# EAGLE schematic AM_BE200_x24_Rev2 (EAGLE 6.5.0), part 1 of 3
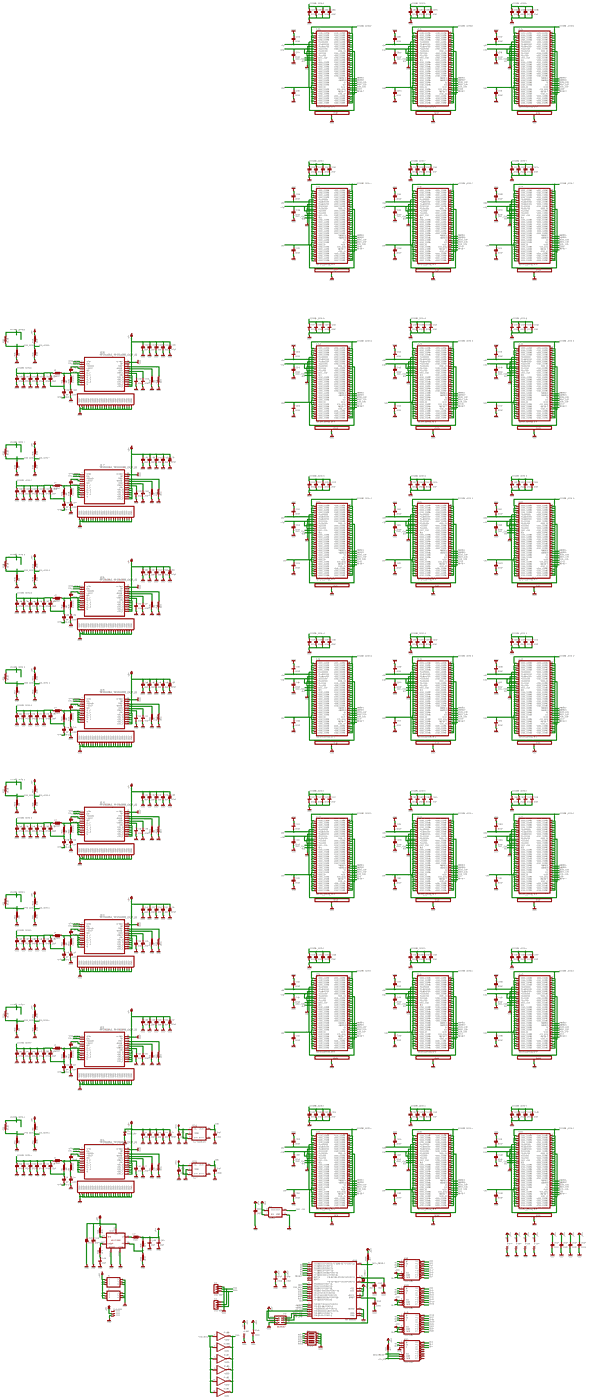
[diagram p0: schematic, sheet 1, overview]
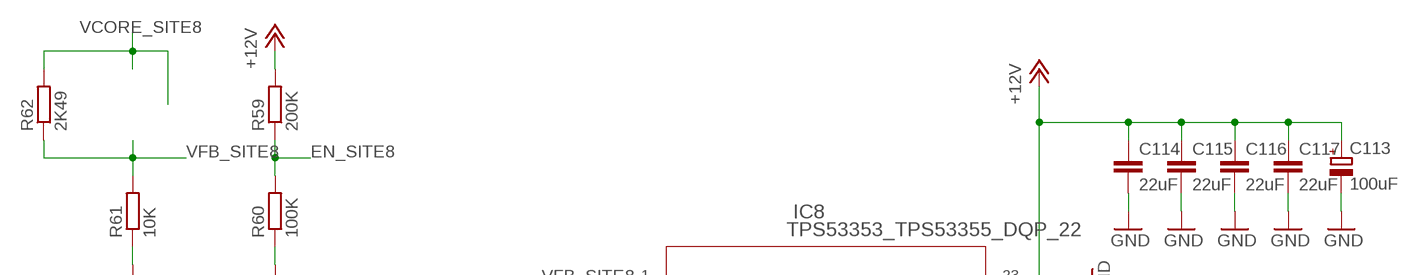
[diagram p1: schematic, sheet 1, part 1 of 8]
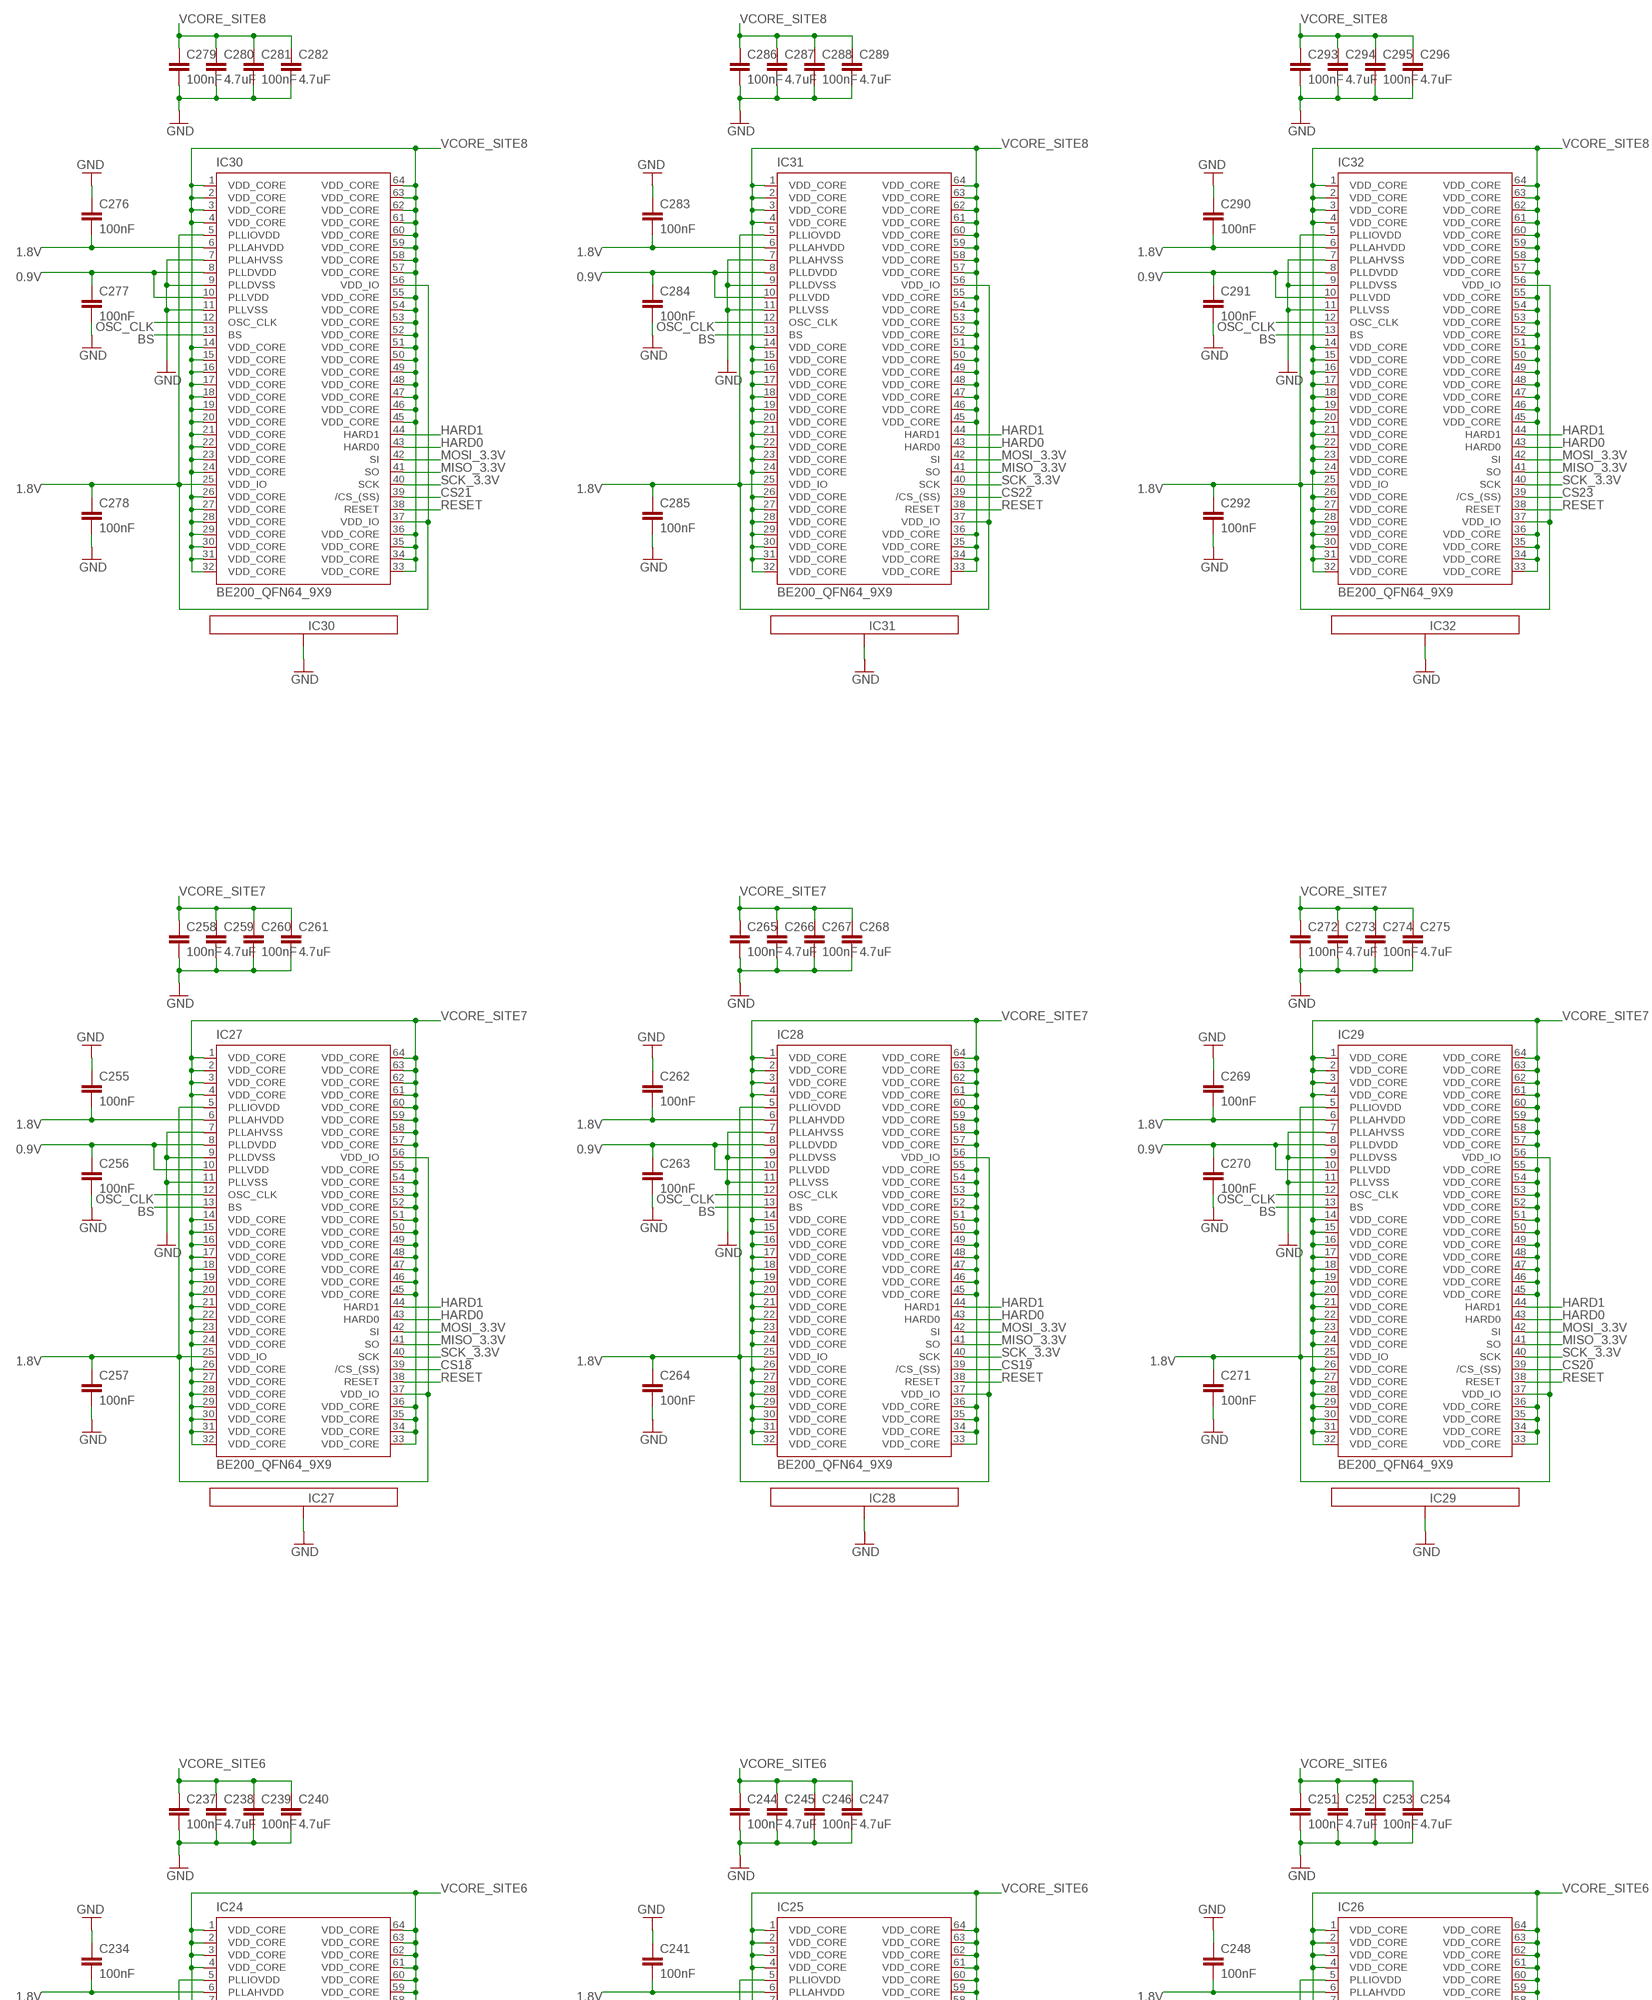
[diagram p2: schematic, sheet 1, part 2 of 8]
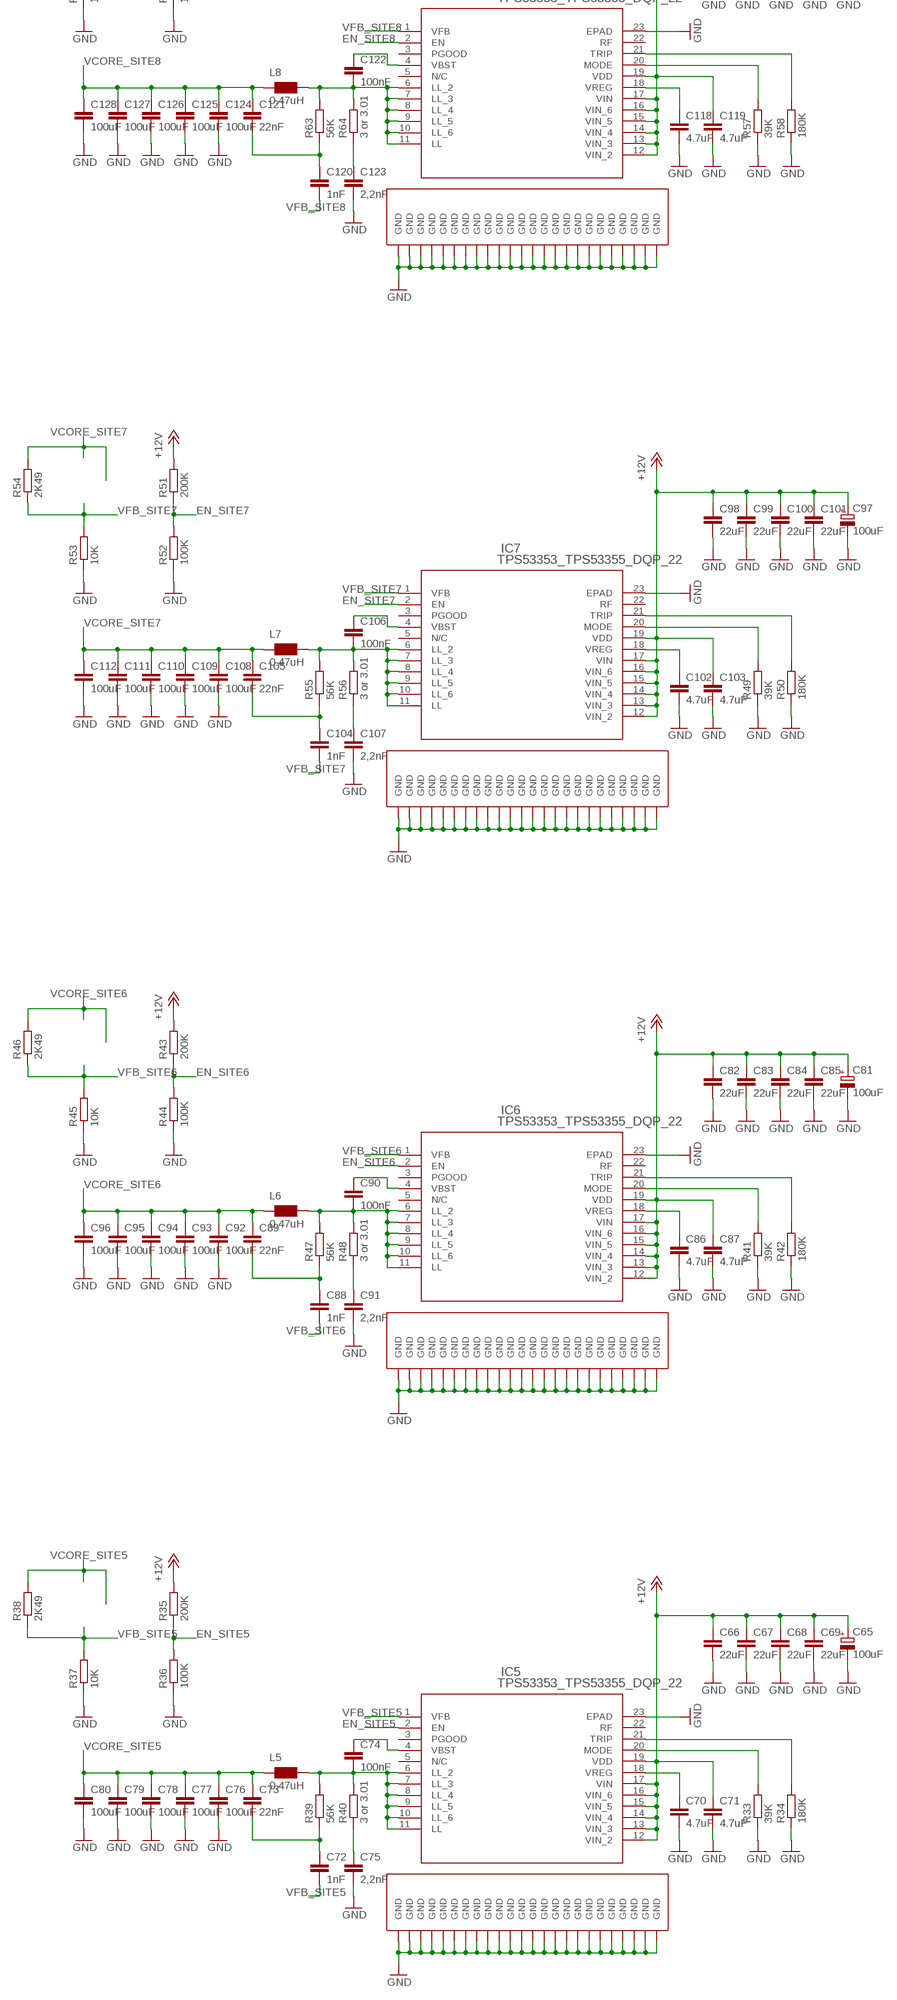
[diagram p3: schematic, sheet 1, part 3 of 8]
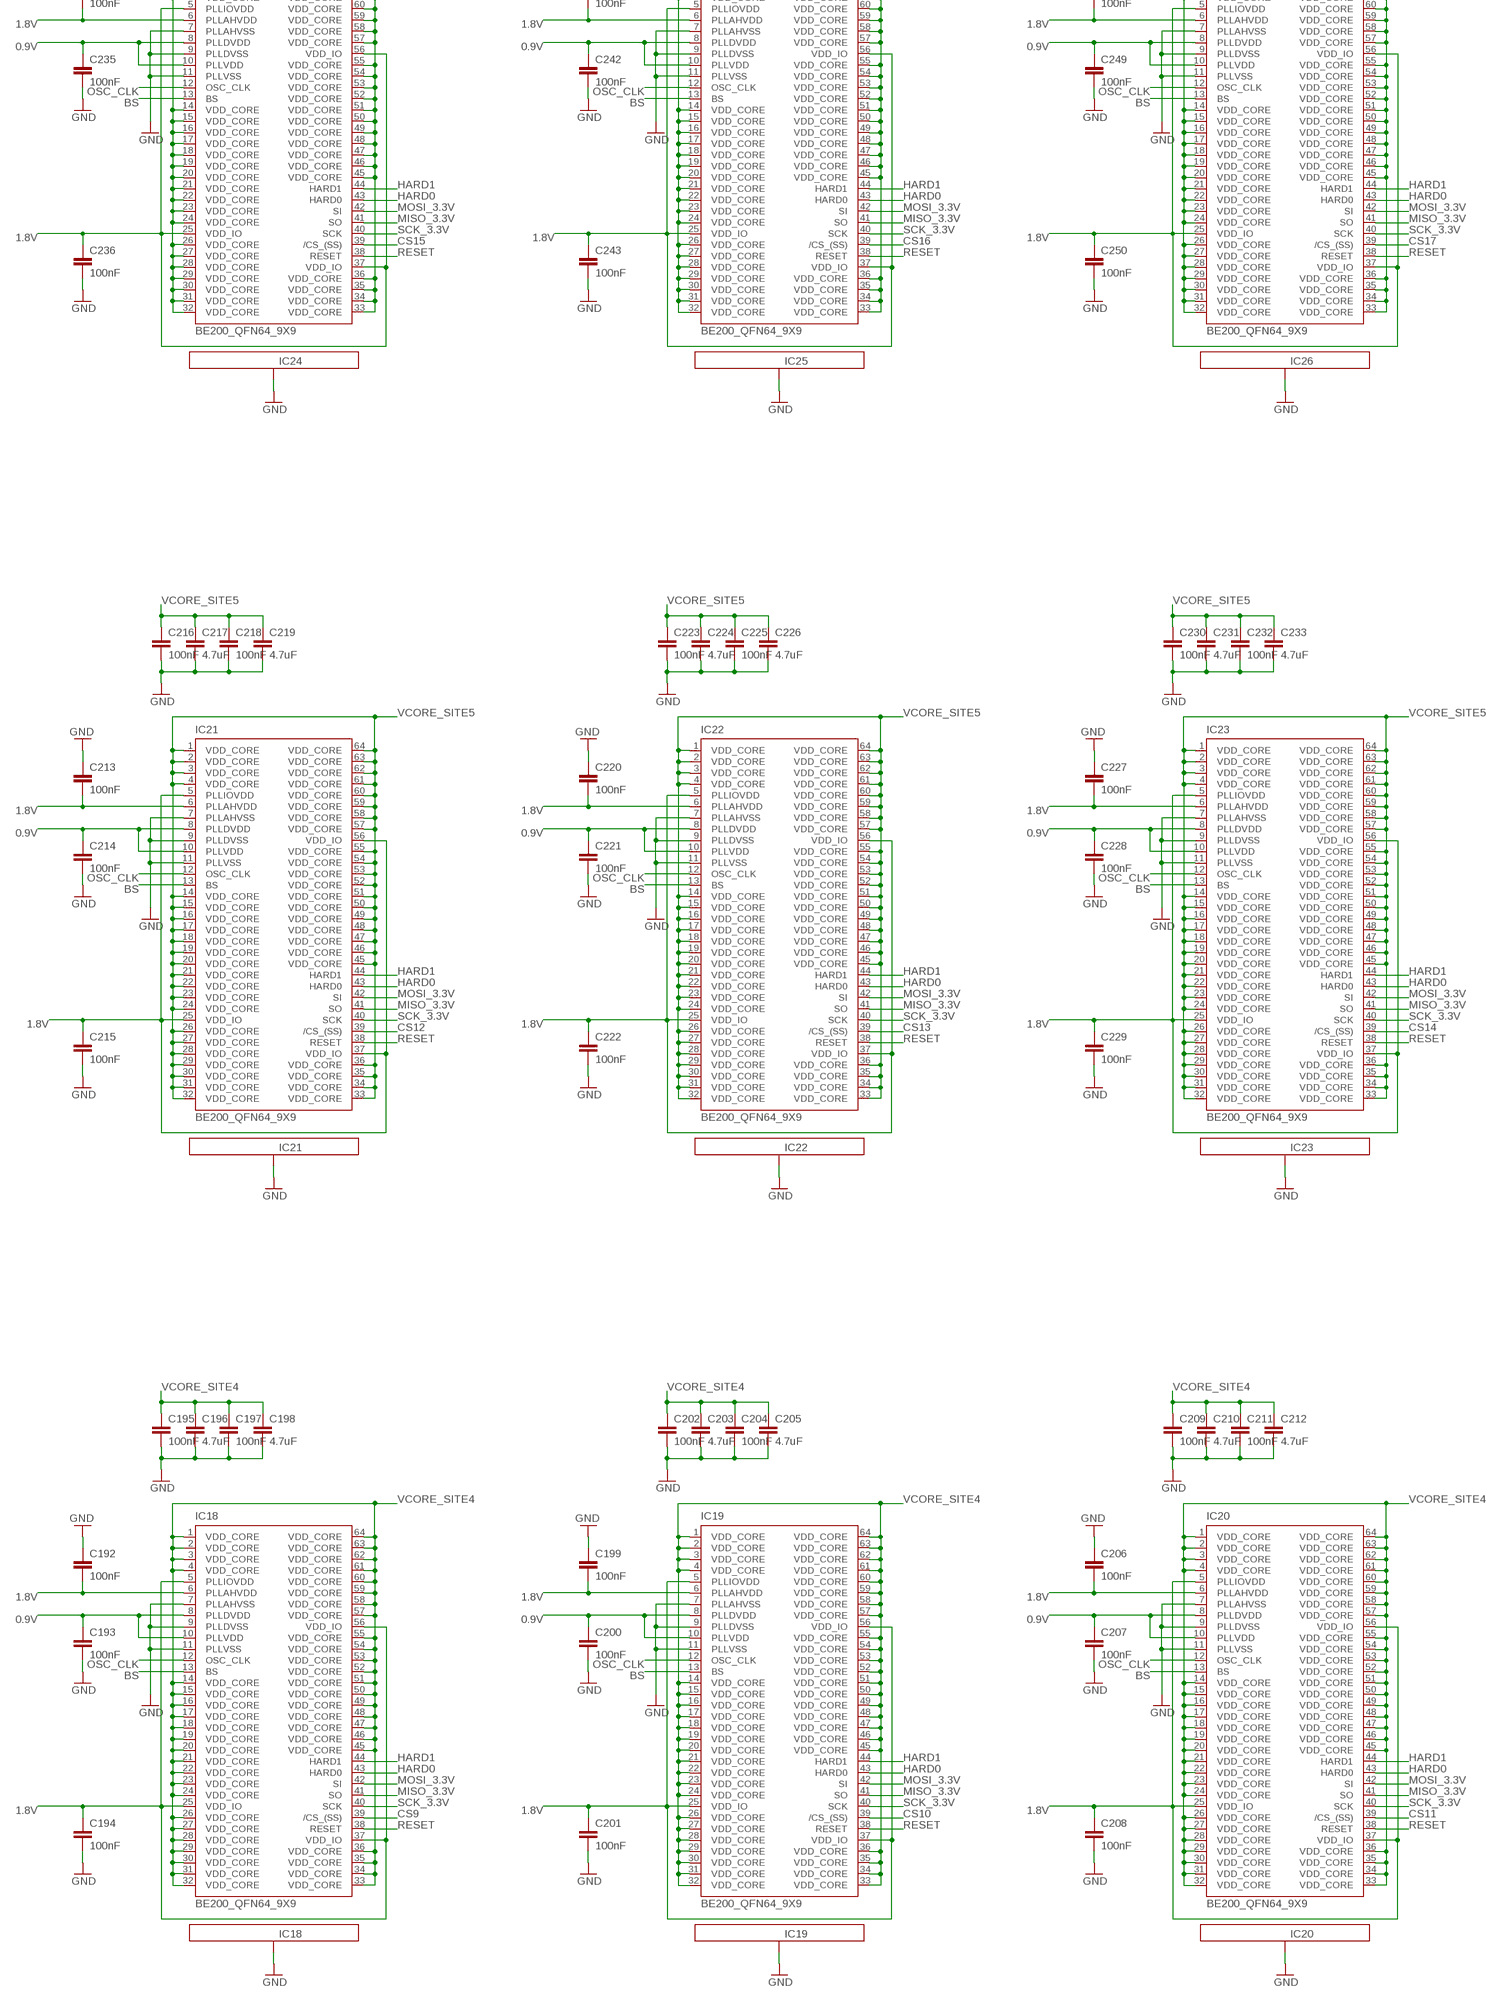
[diagram p4: schematic, sheet 1, part 4 of 8]
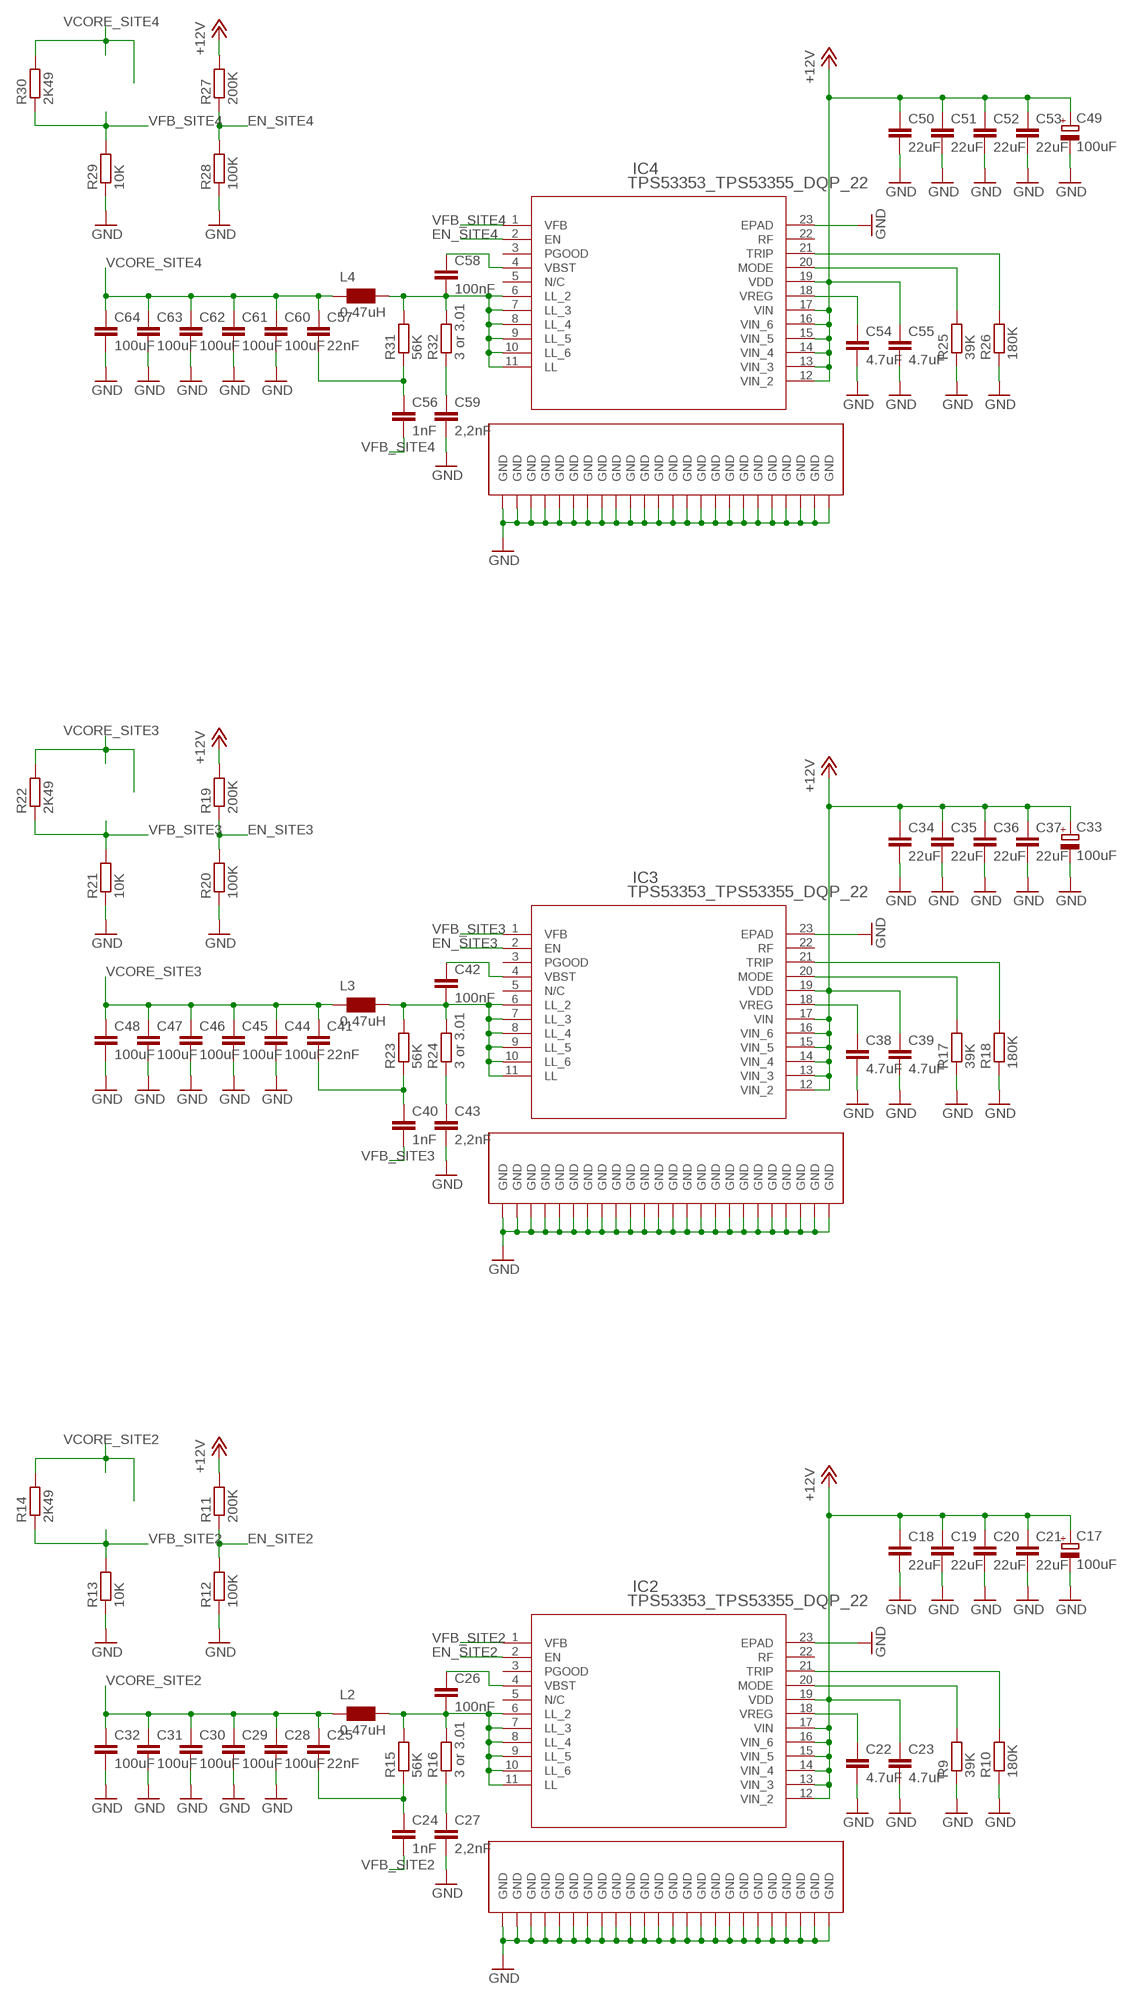
[diagram p5: schematic, sheet 1, part 5 of 8]
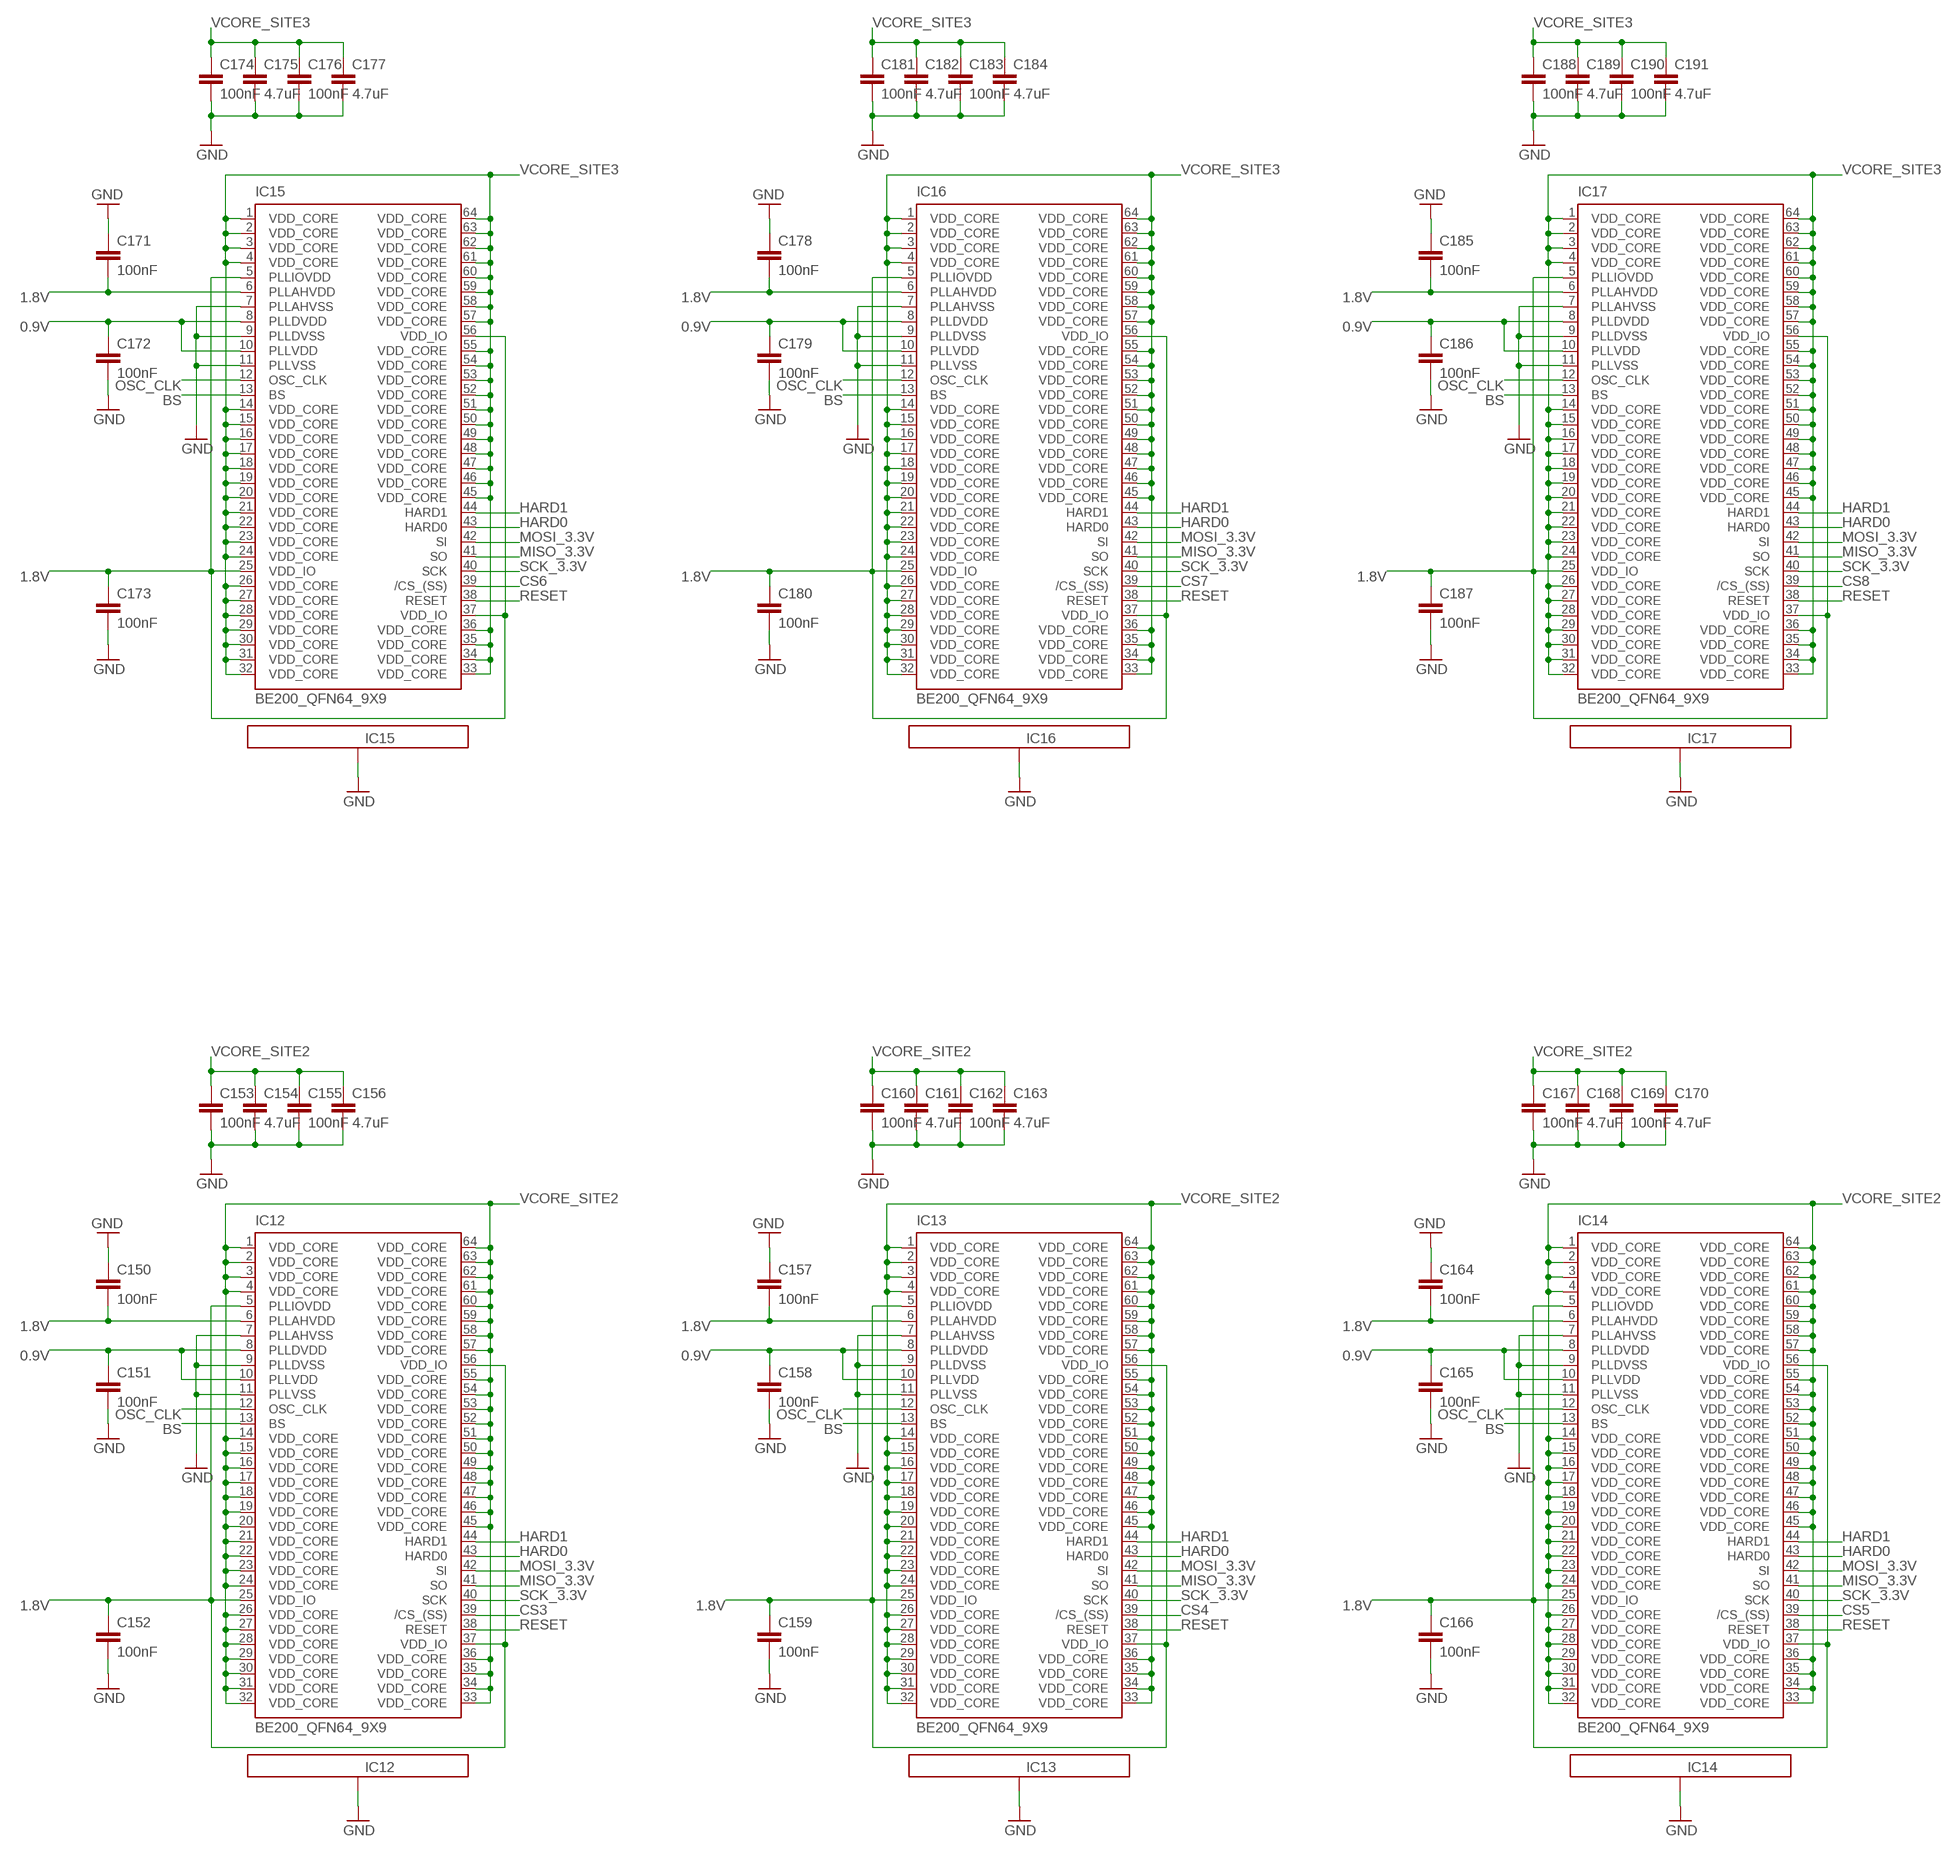
[diagram p6: schematic, sheet 1, part 6 of 8]
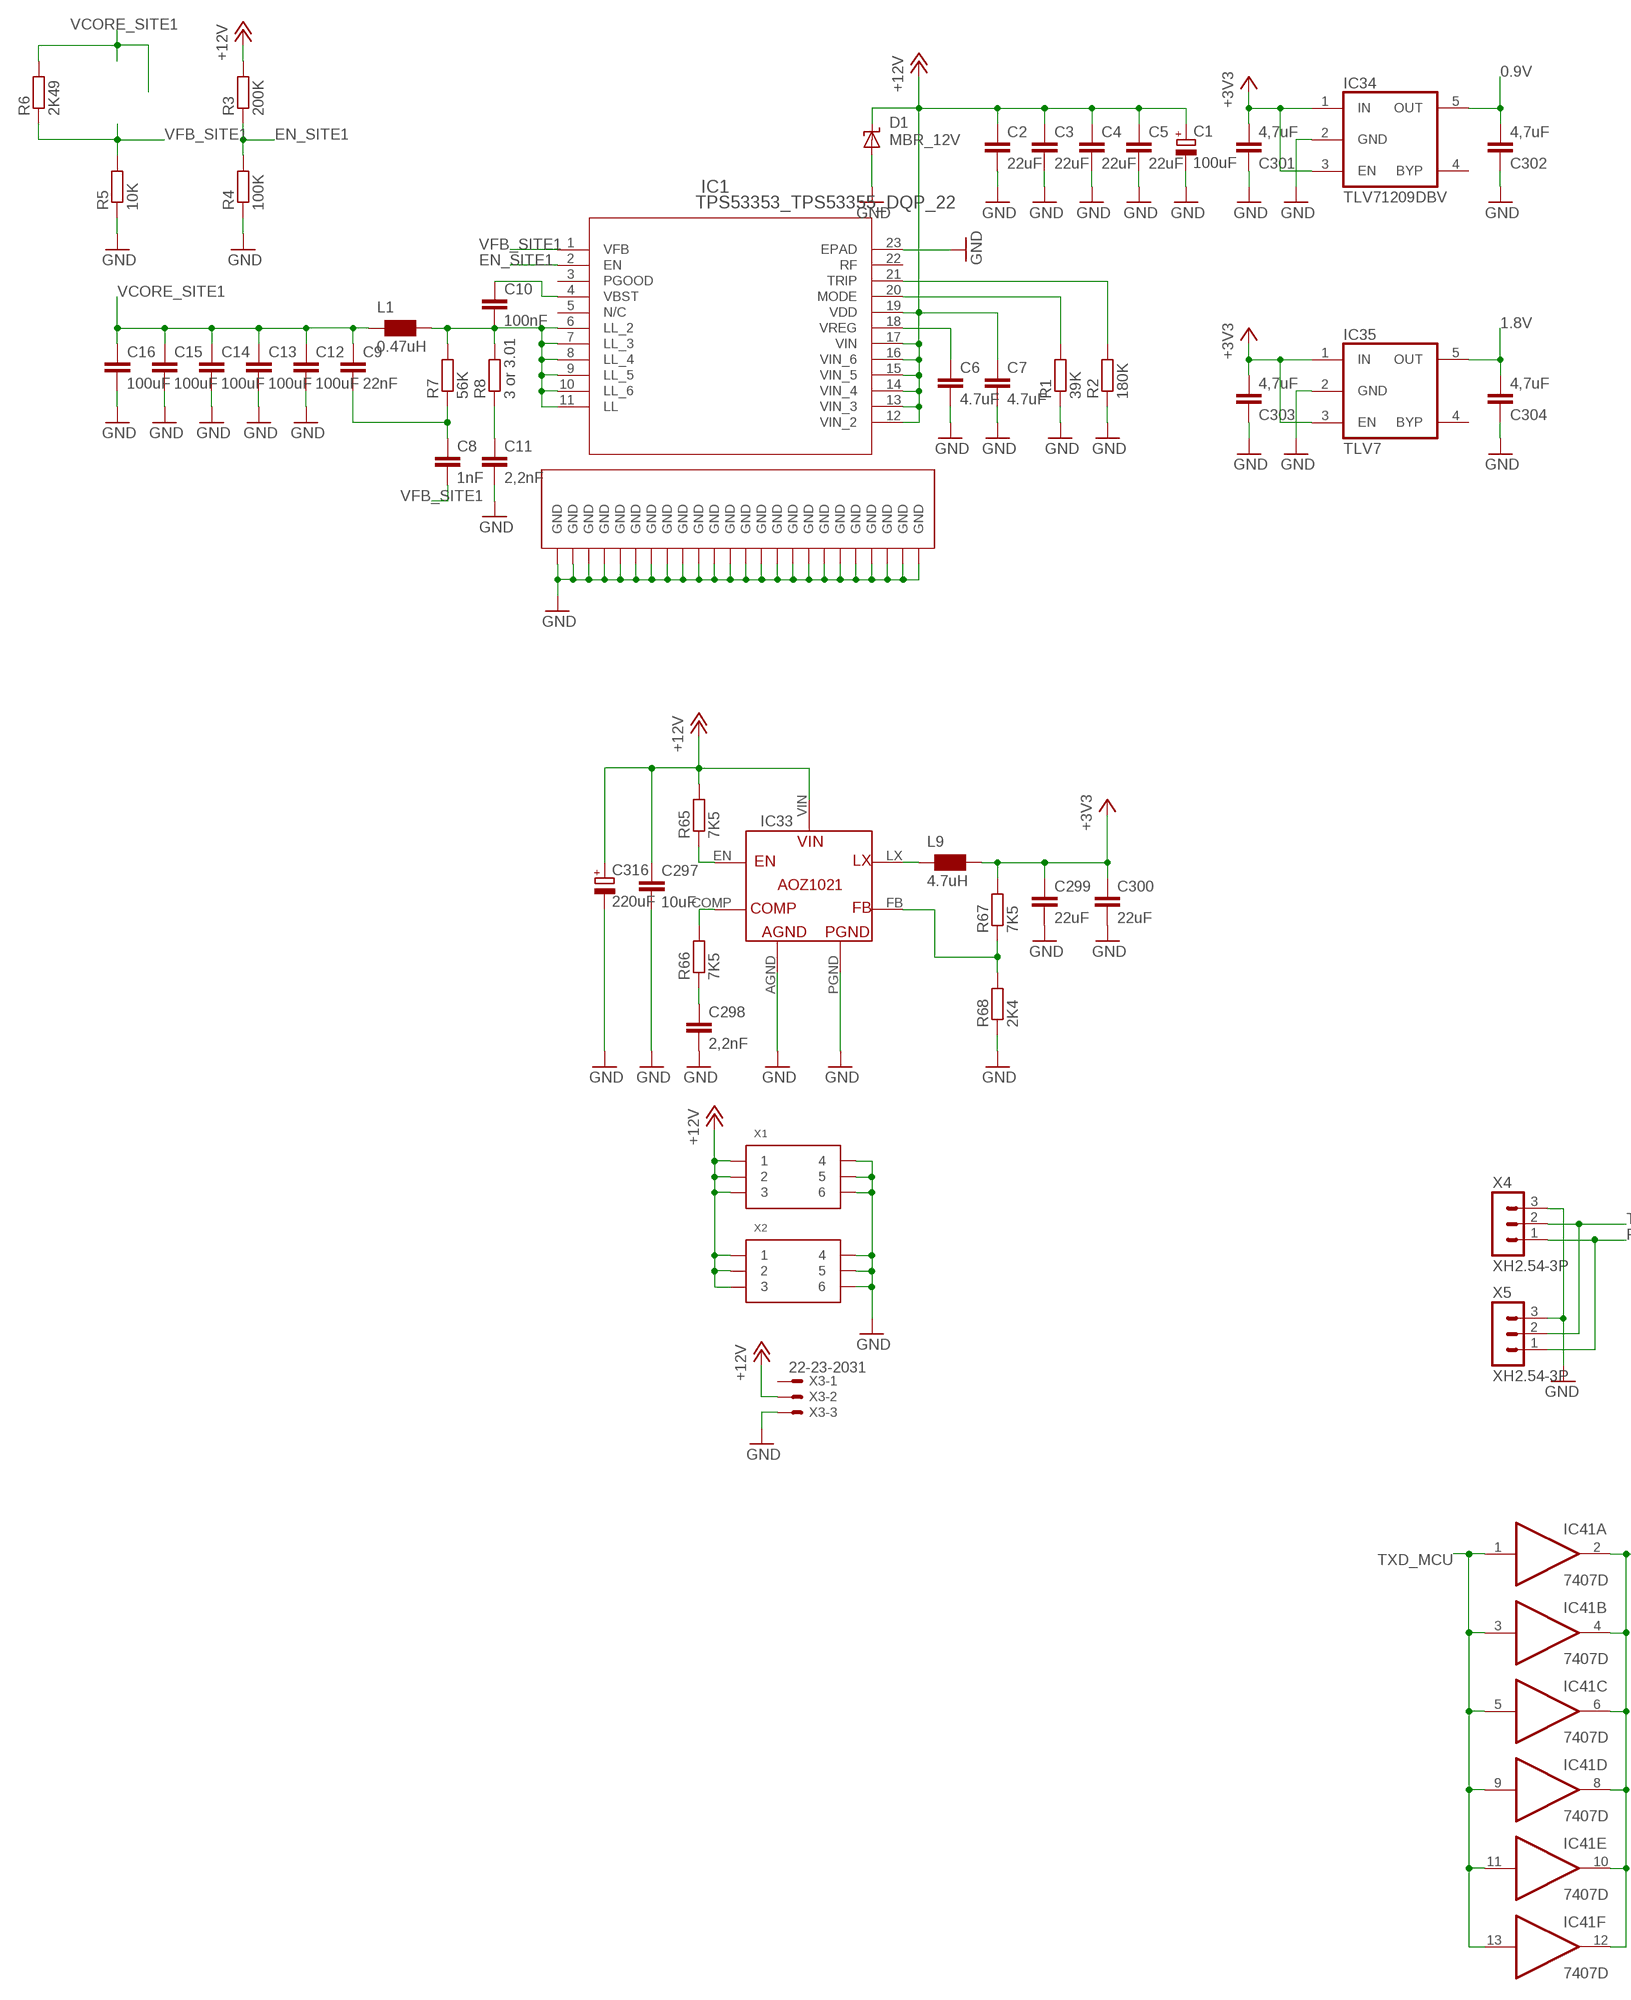
[diagram p7: schematic, sheet 1, part 7 of 8]
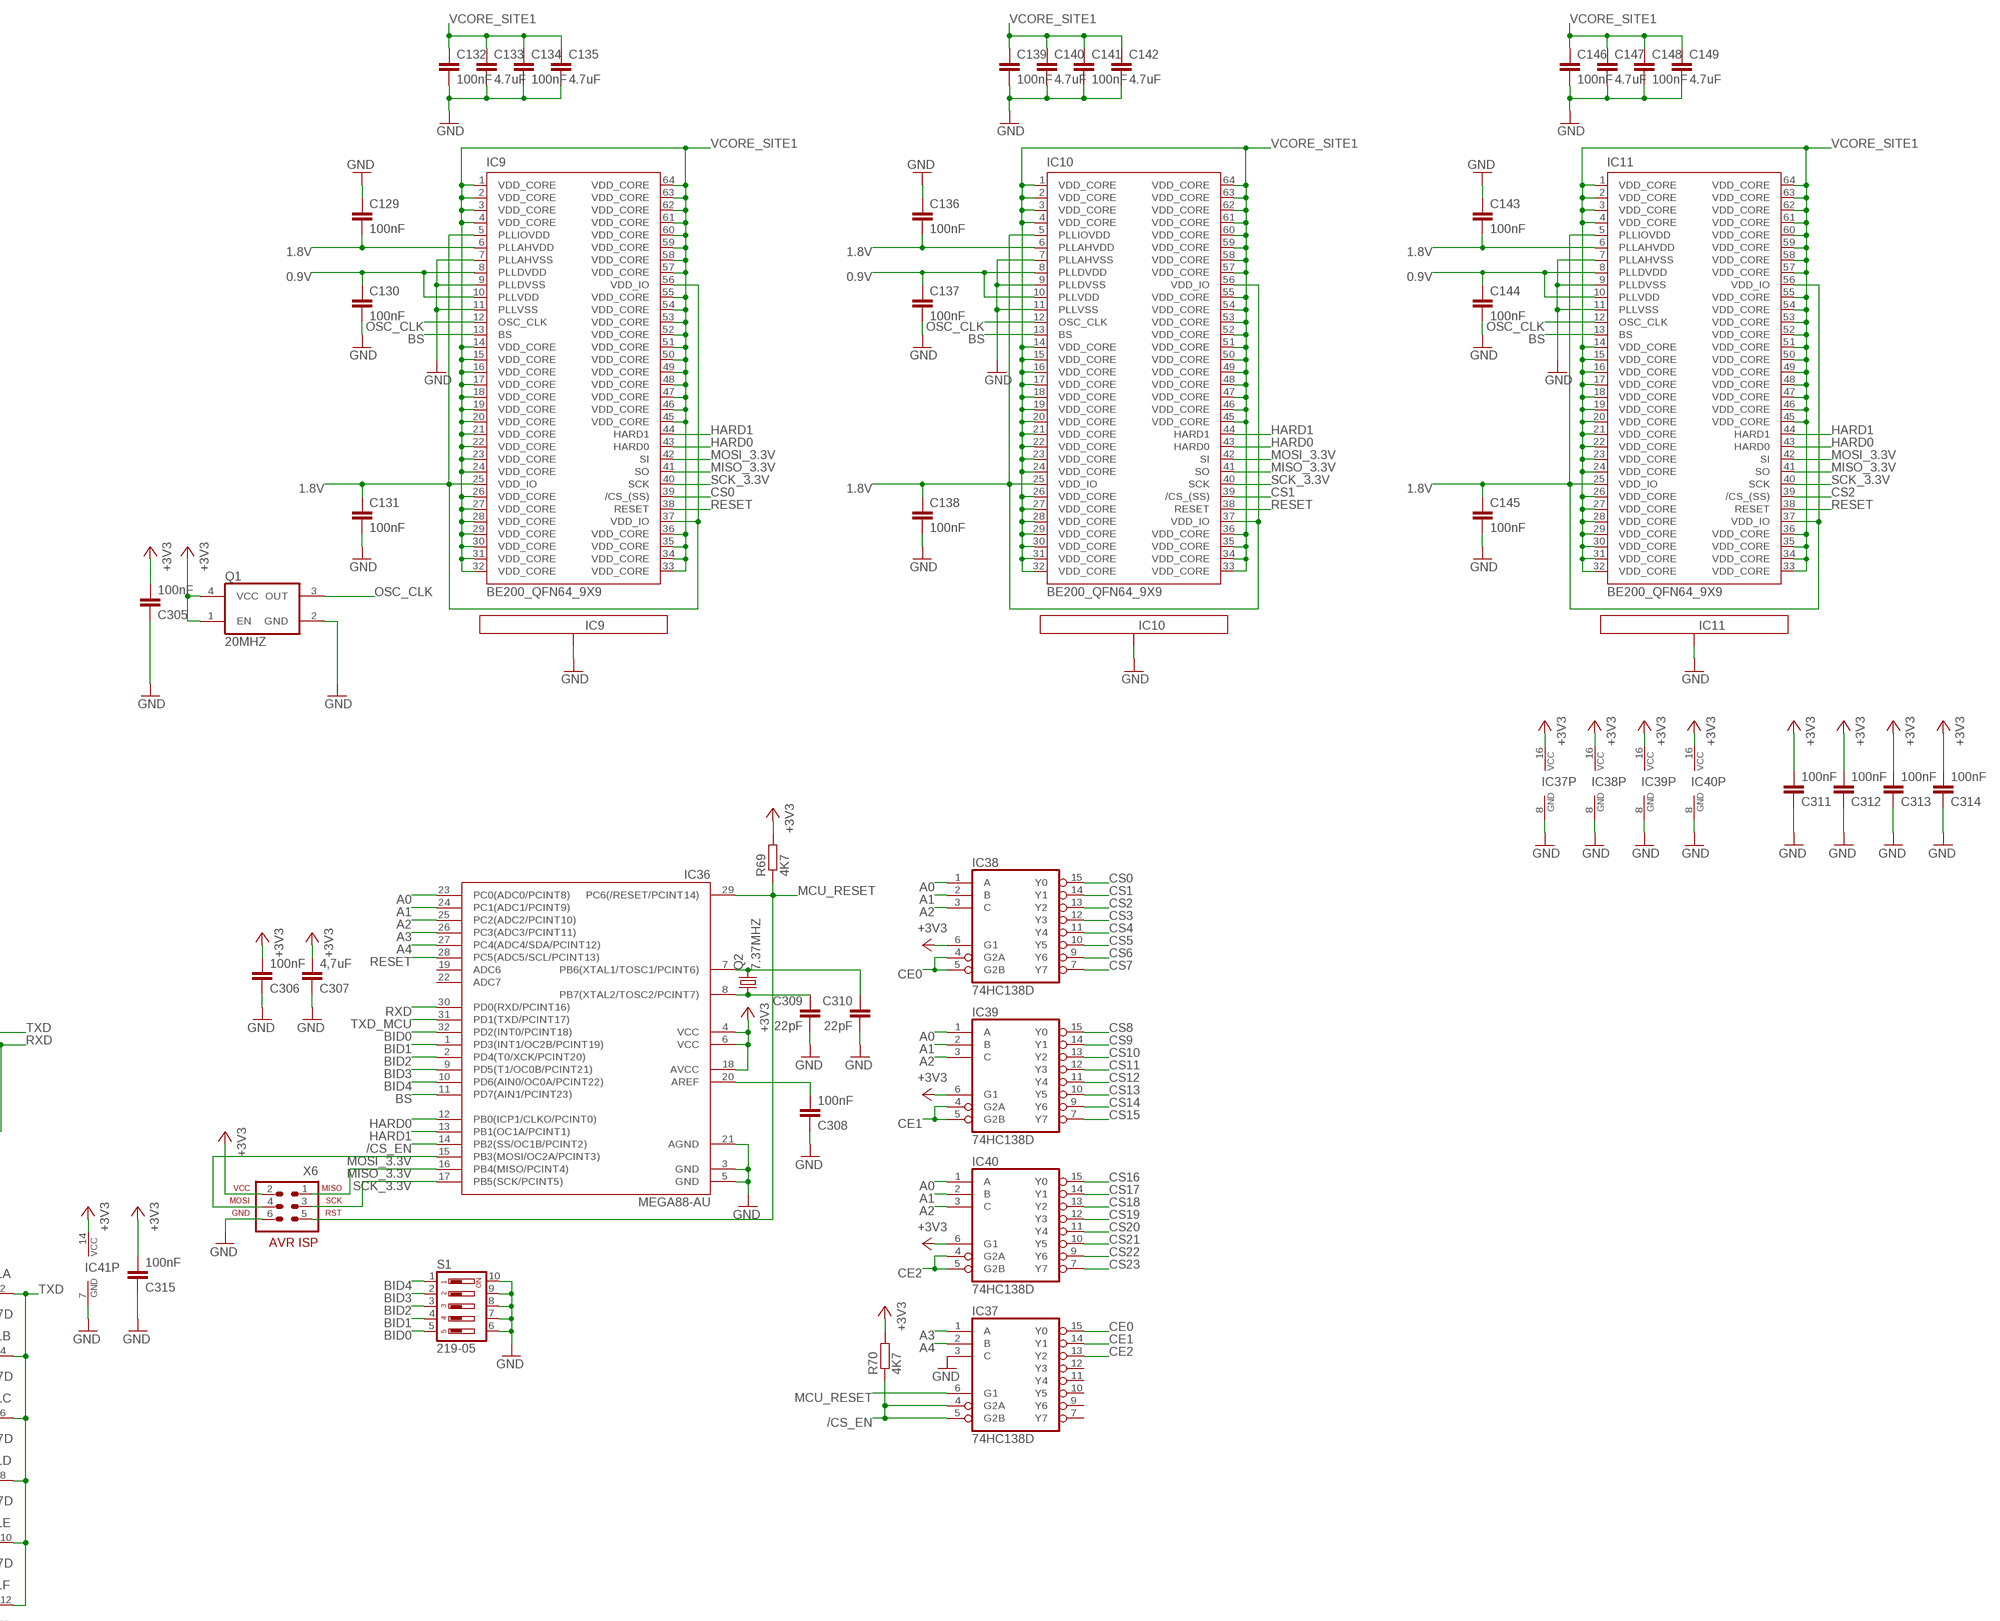
[diagram p8: schematic, sheet 1, part 8 of 8]

## Parts
C1  100uF  CPOL-EU153CLV-0605  [153CLV-0605]
C2  22uF  C-EUC1210K  [C1210K]
C3  22uF  C-EUC1210K  [C1210K]
C4  22uF  C-EUC1210K  [C1210K]
C5  22uF  C-EUC1210K  [C1210K]
C6  4.7uF  C-EUC0805K  [C0805K]
C7  4.7uF  C-EUC0805K  [C0805K]
C8  1nF  C-EUC0805K  [C0805K]
C9  22nF  C-EUC0805K  [C0805K]
C10  100nF  C-EUC0805K  [C0805K]
C11  2,2nF  C-EUC0805K  [C0805K]
C12  100uF  C-EUC1210K  [C1210K]
C13  100uF  C-EUC1210K  [C1210K]
C14  100uF  C-EUC1210K  [C1210K]
C15  100uF  C-EUC1210K  [C1210K]
C16  100uF  C-EUC1210K  [C1210K]
C17  100uF  CPOL-EU153CLV-0605  [153CLV-0605]
C18  22uF  C-EUC1210K  [C1210K]
C19  22uF  C-EUC1210K  [C1210K]
C20  22uF  C-EUC1210K  [C1210K]
C21  22uF  C-EUC1210K  [C1210K]
C22  4.7uF  C-EUC0805K  [C0805K]
C23  4.7uF  C-EUC0805K  [C0805K]
C24  1nF  C-EUC0805K  [C0805K]
C25  22nF  C-EUC0805K  [C0805K]
C26  100nF  C-EUC0805K  [C0805K]
C27  2,2nF  C-EUC0805K  [C0805K]
C28  100uF  C-EUC1210K  [C1210K]
C29  100uF  C-EUC1210K  [C1210K]
C30  100uF  C-EUC1210K  [C1210K]
C31  100uF  C-EUC1210K  [C1210K]
C32  100uF  C-EUC1210K  [C1210K]
C33  100uF  CPOL-EU153CLV-0605  [153CLV-0605]
C34  22uF  C-EUC1210K  [C1210K]
C35  22uF  C-EUC1210K  [C1210K]
C36  22uF  C-EUC1210K  [C1210K]
C37  22uF  C-EUC1210K  [C1210K]
C38  4.7uF  C-EUC0805K  [C0805K]
C39  4.7uF  C-EUC0805K  [C0805K]
C40  1nF  C-EUC0805K  [C0805K]
C41  22nF  C-EUC0805K  [C0805K]
C42  100nF  C-EUC0805K  [C0805K]
C43  2,2nF  C-EUC0805K  [C0805K]
C44  100uF  C-EUC1210K  [C1210K]
C45  100uF  C-EUC1210K  [C1210K]
C46  100uF  C-EUC1210K  [C1210K]
C47  100uF  C-EUC1210K  [C1210K]
C48  100uF  C-EUC1210K  [C1210K]
C49  100uF  CPOL-EU153CLV-0605  [153CLV-0605]
C50  22uF  C-EUC1210K  [C1210K]
C51  22uF  C-EUC1210K  [C1210K]
C52  22uF  C-EUC1210K  [C1210K]
C53  22uF  C-EUC1210K  [C1210K]
C54  4.7uF  C-EUC0805K  [C0805K]
C55  4.7uF  C-EUC0805K  [C0805K]
C56  1nF  C-EUC0805K  [C0805K]
C57  22nF  C-EUC0805K  [C0805K]
C58  100nF  C-EUC0805K  [C0805K]
C59  2,2nF  C-EUC0805K  [C0805K]
C60  100uF  C-EUC1210K  [C1210K]
C61  100uF  C-EUC1210K  [C1210K]
C62  100uF  C-EUC1210K  [C1210K]
C63  100uF  C-EUC1210K  [C1210K]
C64  100uF  C-EUC1210K  [C1210K]
C65  100uF  CPOL-EU153CLV-0605  [153CLV-0605]
C66  22uF  C-EUC1210K  [C1210K]
C67  22uF  C-EUC1210K  [C1210K]
C68  22uF  C-EUC1210K  [C1210K]
C69  22uF  C-EUC1210K  [C1210K]
C70  4.7uF  C-EUC0805K  [C0805K]
C71  4.7uF  C-EUC0805K  [C0805K]
C72  1nF  C-EUC0805K  [C0805K]
C73  22nF  C-EUC0805K  [C0805K]
C74  100nF  C-EUC0805K  [C0805K]
C75  2,2nF  C-EUC0805K  [C0805K]
C76  100uF  C-EUC1210K  [C1210K]
C77  100uF  C-EUC1210K  [C1210K]
C78  100uF  C-EUC1210K  [C1210K]
C79  100uF  C-EUC1210K  [C1210K]
C80  100uF  C-EUC1210K  [C1210K]
C81  100uF  CPOL-EU153CLV-0605  [153CLV-0605]
C82  22uF  C-EUC1210K  [C1210K]
C83  22uF  C-EUC1210K  [C1210K]
C84  22uF  C-EUC1210K  [C1210K]
C85  22uF  C-EUC1210K  [C1210K]
C86  4.7uF  C-EUC0805K  [C0805K]
C87  4.7uF  C-EUC0805K  [C0805K]
C88  1nF  C-EUC0805K  [C0805K]
C89  22nF  C-EUC0805K  [C0805K]
C90  100nF  C-EUC0805K  [C0805K]
C91  2,2nF  C-EUC0805K  [C0805K]
C92  100uF  C-EUC1210K  [C1210K]
C93  100uF  C-EUC1210K  [C1210K]
C94  100uF  C-EUC1210K  [C1210K]
C95  100uF  C-EUC1210K  [C1210K]
C96  100uF  C-EUC1210K  [C1210K]
C97  100uF  CPOL-EU153CLV-0605  [153CLV-0605]
C98  22uF  C-EUC1210K  [C1210K]
C99  22uF  C-EUC1210K  [C1210K]
C100  22uF  C-EUC1210K  [C1210K]
C101  22uF  C-EUC1210K  [C1210K]
C102  4.7uF  C-EUC0805K  [C0805K]
C103  4.7uF  C-EUC0805K  [C0805K]
C104  1nF  C-EUC0805K  [C0805K]
C105  22nF  C-EUC0805K  [C0805K]
C106  100nF  C-EUC0805K  [C0805K]
C107  2,2nF  C-EUC0805K  [C0805K]
C108  100uF  C-EUC1210K  [C1210K]
C109  100uF  C-EUC1210K  [C1210K]
C110  100uF  C-EUC1210K  [C1210K]
C111  100uF  C-EUC1210K  [C1210K]
C112  100uF  C-EUC1210K  [C1210K]
C113  100uF  CPOL-EU153CLV-0605  [153CLV-0605]
C114  22uF  C-EUC1210K  [C1210K]
C115  22uF  C-EUC1210K  [C1210K]
C116  22uF  C-EUC1210K  [C1210K]
C117  22uF  C-EUC1210K  [C1210K]
C118  4.7uF  C-EUC0805K  [C0805K]
C119  4.7uF  C-EUC0805K  [C0805K]
C120  1nF  C-EUC0805K  [C0805K]
C121  22nF  C-EUC0805K  [C0805K]
C122  100nF  C-EUC0805K  [C0805K]
C123  2,2nF  C-EUC0805K  [C0805K]
C124  100uF  C-EUC1210K  [C1210K]
C125  100uF  C-EUC1210K  [C1210K]
C126  100uF  C-EUC1210K  [C1210K]
C127  100uF  C-EUC1210K  [C1210K]
C128  100uF  C-EUC1210K  [C1210K]
C129  100nF  MYRCL_C-EUC0603K  [MYRCL_C0603K]
C130  100nF  MYRCL_C-EUC0603K  [MYRCL_C0603K]
C131  100nF  MYRCL_C-EUC0603K  [MYRCL_C0603K]
C132  100nF  MYRCL_C-EUC0603K  [MYRCL_C0603K]
C133  4.7uF  MYRCL_C-EUC0603K  [MYRCL_C0603K]
C134  100nF  MYRCL_C-EUC0603K  [MYRCL_C0603K]
C135  4.7uF  MYRCL_C-EUC0603K  [MYRCL_C0603K]
C136  100nF  MYRCL_C-EUC0603K  [MYRCL_C0603K]
C137  100nF  MYRCL_C-EUC0603K  [MYRCL_C0603K]
C138  100nF  MYRCL_C-EUC0603K  [MYRCL_C0603K]
C139  100nF  MYRCL_C-EUC0603K  [MYRCL_C0603K]
C140  4.7uF  MYRCL_C-EUC0603K  [MYRCL_C0603K]
C141  100nF  MYRCL_C-EUC0603K  [MYRCL_C0603K]
C142  4.7uF  MYRCL_C-EUC0603K  [MYRCL_C0603K]
C143  100nF  MYRCL_C-EUC0603K  [MYRCL_C0603K]
C144  100nF  MYRCL_C-EUC0603K  [MYRCL_C0603K]
C145  100nF  MYRCL_C-EUC0603K  [MYRCL_C0603K]
C146  100nF  MYRCL_C-EUC0603K  [MYRCL_C0603K]
C147  4.7uF  MYRCL_C-EUC0603K  [MYRCL_C0603K]
C148  100nF  MYRCL_C-EUC0603K  [MYRCL_C0603K]
C149  4.7uF  MYRCL_C-EUC0603K  [MYRCL_C0603K]
C150  100nF  MYRCL_C-EUC0603K  [MYRCL_C0603K]
C151  100nF  MYRCL_C-EUC0603K  [MYRCL_C0603K]
C152  100nF  MYRCL_C-EUC0603K  [MYRCL_C0603K]
C153  100nF  MYRCL_C-EUC0603K  [MYRCL_C0603K]
C154  4.7uF  MYRCL_C-EUC0603K  [MYRCL_C0603K]
C155  100nF  MYRCL_C-EUC0603K  [MYRCL_C0603K]
C156  4.7uF  MYRCL_C-EUC0603K  [MYRCL_C0603K]
C157  100nF  MYRCL_C-EUC0603K  [MYRCL_C0603K]
C158  100nF  MYRCL_C-EUC0603K  [MYRCL_C0603K]
C159  100nF  MYRCL_C-EUC0603K  [MYRCL_C0603K]
C160  100nF  MYRCL_C-EUC0603K  [MYRCL_C0603K]
C161  4.7uF  MYRCL_C-EUC0603K  [MYRCL_C0603K]
C162  100nF  MYRCL_C-EUC0603K  [MYRCL_C0603K]
C163  4.7uF  MYRCL_C-EUC0603K  [MYRCL_C0603K]
C164  100nF  MYRCL_C-EUC0603K  [MYRCL_C0603K]
C165  100nF  MYRCL_C-EUC0603K  [MYRCL_C0603K]
C166  100nF  MYRCL_C-EUC0603K  [MYRCL_C0603K]
C167  100nF  MYRCL_C-EUC0603K  [MYRCL_C0603K]
C168  4.7uF  MYRCL_C-EUC0603K  [MYRCL_C0603K]
C169  100nF  MYRCL_C-EUC0603K  [MYRCL_C0603K]
C170  4.7uF  MYRCL_C-EUC0603K  [MYRCL_C0603K]
C171  100nF  MYRCL_C-EUC0603K  [MYRCL_C0603K]
C172  100nF  MYRCL_C-EUC0603K  [MYRCL_C0603K]
C173  100nF  MYRCL_C-EUC0603K  [MYRCL_C0603K]
C174  100nF  MYRCL_C-EUC0603K  [MYRCL_C0603K]
C175  4.7uF  MYRCL_C-EUC0603K  [MYRCL_C0603K]
C176  100nF  MYRCL_C-EUC0603K  [MYRCL_C0603K]
C177  4.7uF  MYRCL_C-EUC0603K  [MYRCL_C0603K]
C178  100nF  MYRCL_C-EUC0603K  [MYRCL_C0603K]
C179  100nF  MYRCL_C-EUC0603K  [MYRCL_C0603K]
C180  100nF  MYRCL_C-EUC0603K  [MYRCL_C0603K]
C181  100nF  MYRCL_C-EUC0603K  [MYRCL_C0603K]
C182  4.7uF  MYRCL_C-EUC0603K  [MYRCL_C0603K]
C183  100nF  MYRCL_C-EUC0603K  [MYRCL_C0603K]
C184  4.7uF  MYRCL_C-EUC0603K  [MYRCL_C0603K]
C185  100nF  MYRCL_C-EUC0603K  [MYRCL_C0603K]
C186  100nF  MYRCL_C-EUC0603K  [MYRCL_C0603K]
C187  100nF  MYRCL_C-EUC0603K  [MYRCL_C0603K]
C188  100nF  MYRCL_C-EUC0603K  [MYRCL_C0603K]
C189  4.7uF  MYRCL_C-EUC0603K  [MYRCL_C0603K]
C190  100nF  MYRCL_C-EUC0603K  [MYRCL_C0603K]
C191  4.7uF  MYRCL_C-EUC0603K  [MYRCL_C0603K]
C192  100nF  MYRCL_C-EUC0603K  [MYRCL_C0603K]
C193  100nF  MYRCL_C-EUC0603K  [MYRCL_C0603K]
C194  100nF  MYRCL_C-EUC0603K  [MYRCL_C0603K]
C195  100nF  MYRCL_C-EUC0603K  [MYRCL_C0603K]
C196  4.7uF  MYRCL_C-EUC0603K  [MYRCL_C0603K]
C197  100nF  MYRCL_C-EUC0603K  [MYRCL_C0603K]
C198  4.7uF  MYRCL_C-EUC0603K  [MYRCL_C0603K]
C199  100nF  MYRCL_C-EUC0603K  [MYRCL_C0603K]
C200  100nF  MYRCL_C-EUC0603K  [MYRCL_C0603K]
C201  100nF  MYRCL_C-EUC0603K  [MYRCL_C0603K]
C202  100nF  MYRCL_C-EUC0603K  [MYRCL_C0603K]
C203  4.7uF  MYRCL_C-EUC0603K  [MYRCL_C0603K]
C204  100nF  MYRCL_C-EUC0603K  [MYRCL_C0603K]
C205  4.7uF  MYRCL_C-EUC0603K  [MYRCL_C0603K]
C206  100nF  MYRCL_C-EUC0603K  [MYRCL_C0603K]
C207  100nF  MYRCL_C-EUC0603K  [MYRCL_C0603K]
C208  100nF  MYRCL_C-EUC0603K  [MYRCL_C0603K]
C209  100nF  MYRCL_C-EUC0603K  [MYRCL_C0603K]
C210  4.7uF  MYRCL_C-EUC0603K  [MYRCL_C0603K]
C211  100nF  MYRCL_C-EUC0603K  [MYRCL_C0603K]
C212  4.7uF  MYRCL_C-EUC0603K  [MYRCL_C0603K]
C213  100nF  MYRCL_C-EUC0603K  [MYRCL_C0603K]
C214  100nF  MYRCL_C-EUC0603K  [MYRCL_C0603K]
C215  100nF  MYRCL_C-EUC0603K  [MYRCL_C0603K]
C216  100nF  MYRCL_C-EUC0603K  [MYRCL_C0603K]
C217  4.7uF  MYRCL_C-EUC0603K  [MYRCL_C0603K]
C218  100nF  MYRCL_C-EUC0603K  [MYRCL_C0603K]
C219  4.7uF  MYRCL_C-EUC0603K  [MYRCL_C0603K]
C220  100nF  MYRCL_C-EUC0603K  [MYRCL_C0603K]
C221  100nF  MYRCL_C-EUC0603K  [MYRCL_C0603K]
C222  100nF  MYRCL_C-EUC0603K  [MYRCL_C0603K]
C223  100nF  MYRCL_C-EUC0603K  [MYRCL_C0603K]
C224  4.7uF  MYRCL_C-EUC0603K  [MYRCL_C0603K]
C225  100nF  MYRCL_C-EUC0603K  [MYRCL_C0603K]
C226  4.7uF  MYRCL_C-EUC0603K  [MYRCL_C0603K]
C227  100nF  MYRCL_C-EUC0603K  [MYRCL_C0603K]
C228  100nF  MYRCL_C-EUC0603K  [MYRCL_C0603K]
C229  100nF  MYRCL_C-EUC0603K  [MYRCL_C0603K]
C230  100nF  MYRCL_C-EUC0603K  [MYRCL_C0603K]
C231  4.7uF  MYRCL_C-EUC0603K  [MYRCL_C0603K]
C232  100nF  MYRCL_C-EUC0603K  [MYRCL_C0603K]
C233  4.7uF  MYRCL_C-EUC0603K  [MYRCL_C0603K]
C234  100nF  MYRCL_C-EUC0603K  [MYRCL_C0603K]
C235  100nF  MYRCL_C-EUC0603K  [MYRCL_C0603K]
C236  100nF  MYRCL_C-EUC0603K  [MYRCL_C0603K]
C237  100nF  MYRCL_C-EUC0603K  [MYRCL_C0603K]
C238  4.7uF  MYRCL_C-EUC0603K  [MYRCL_C0603K]
C239  100nF  MYRCL_C-EUC0603K  [MYRCL_C0603K]
C240  4.7uF  MYRCL_C-EUC0603K  [MYRCL_C0603K]
C241  100nF  MYRCL_C-EUC0603K  [MYRCL_C0603K]
C242  100nF  MYRCL_C-EUC0603K  [MYRCL_C0603K]
C243  100nF  MYRCL_C-EUC0603K  [MYRCL_C0603K]
C244  100nF  MYRCL_C-EUC0603K  [MYRCL_C0603K]
C245  4.7uF  MYRCL_C-EUC0603K  [MYRCL_C0603K]
C246  100nF  MYRCL_C-EUC0603K  [MYRCL_C0603K]
C247  4.7uF  MYRCL_C-EUC0603K  [MYRCL_C0603K]
C248  100nF  MYRCL_C-EUC0603K  [MYRCL_C0603K]
C249  100nF  MYRCL_C-EUC0603K  [MYRCL_C0603K]
C250  100nF  MYRCL_C-EUC0603K  [MYRCL_C0603K]
C251  100nF  MYRCL_C-EUC0603K  [MYRCL_C0603K]
C252  4.7uF  MYRCL_C-EUC0603K  [MYRCL_C0603K]
C253  100nF  MYRCL_C-EUC0603K  [MYRCL_C0603K]
C254  4.7uF  MYRCL_C-EUC0603K  [MYRCL_C0603K]
C255  100nF  MYRCL_C-EUC0603K  [MYRCL_C0603K]
C256  100nF  MYRCL_C-EUC0603K  [MYRCL_C0603K]
C257  100nF  MYRCL_C-EUC0603K  [MYRCL_C0603K]
C258  100nF  MYRCL_C-EUC0603K  [MYRCL_C0603K]
C259  4.7uF  MYRCL_C-EUC0603K  [MYRCL_C0603K]
C260  100nF  MYRCL_C-EUC0603K  [MYRCL_C0603K]
C261  4.7uF  MYRCL_C-EUC0603K  [MYRCL_C0603K]
C262  100nF  MYRCL_C-EUC0603K  [MYRCL_C0603K]
C263  100nF  MYRCL_C-EUC0603K  [MYRCL_C0603K]
C264  100nF  MYRCL_C-EUC0603K  [MYRCL_C0603K]
C265  100nF  MYRCL_C-EUC0603K  [MYRCL_C0603K]
C266  4.7uF  MYRCL_C-EUC0603K  [MYRCL_C0603K]
C267  100nF  MYRCL_C-EUC0603K  [MYRCL_C0603K]
C268  4.7uF  MYRCL_C-EUC0603K  [MYRCL_C0603K]
C269  100nF  MYRCL_C-EUC0603K  [MYRCL_C0603K]
C270  100nF  MYRCL_C-EUC0603K  [MYRCL_C0603K]
C271  100nF  MYRCL_C-EUC0603K  [MYRCL_C0603K]
C272  100nF  MYRCL_C-EUC0603K  [MYRCL_C0603K]
C273  4.7uF  MYRCL_C-EUC0603K  [MYRCL_C0603K]
C274  100nF  MYRCL_C-EUC0603K  [MYRCL_C0603K]
C275  4.7uF  MYRCL_C-EUC0603K  [MYRCL_C0603K]
C276  100nF  MYRCL_C-EUC0603K  [MYRCL_C0603K]
C277  100nF  MYRCL_C-EUC0603K  [MYRCL_C0603K]
C278  100nF  MYRCL_C-EUC0603K  [MYRCL_C0603K]
C279  100nF  MYRCL_C-EUC0603K  [MYRCL_C0603K]
C280  4.7uF  MYRCL_C-EUC0603K  [MYRCL_C0603K]
C281  100nF  MYRCL_C-EUC0603K  [MYRCL_C0603K]
C282  4.7uF  MYRCL_C-EUC0603K  [MYRCL_C0603K]
C283  100nF  MYRCL_C-EUC0603K  [MYRCL_C0603K]
C284  100nF  MYRCL_C-EUC0603K  [MYRCL_C0603K]
C285  100nF  MYRCL_C-EUC0603K  [MYRCL_C0603K]
C286  100nF  MYRCL_C-EUC0603K  [MYRCL_C0603K]
C287  4.7uF  MYRCL_C-EUC0603K  [MYRCL_C0603K]
C288  100nF  MYRCL_C-EUC0603K  [MYRCL_C0603K]
C289  4.7uF  MYRCL_C-EUC0603K  [MYRCL_C0603K]
C290  100nF  MYRCL_C-EUC0603K  [MYRCL_C0603K]
C291  100nF  MYRCL_C-EUC0603K  [MYRCL_C0603K]
C292  100nF  MYRCL_C-EUC0603K  [MYRCL_C0603K]
C293  100nF  MYRCL_C-EUC0603K  [MYRCL_C0603K]
C294  4.7uF  MYRCL_C-EUC0603K  [MYRCL_C0603K]
C295  100nF  MYRCL_C-EUC0603K  [MYRCL_C0603K]
C296  4.7uF  MYRCL_C-EUC0603K  [MYRCL_C0603K]
C297  10uF  C-EUC1206K  [C1206K]
C298  2,2nF  C-EUC0805K  [C0805K]
C299  22uF  C-EUC1206K  [C1206K]
C300  22uF  C-EUC1206K  [C1206K]
C301  4,7uF  C-EUC0805K  [C0805K]
C302  4,7uF  C-EUC0805K  [C0805K]
C303  4,7uF  C-EUC0805K  [C0805K]
C304  4,7uF  C-EUC0805K  [C0805K]
C305  100nF  C-EUC0805K  [C0805K]
C306  100nF  C-EUC0805K  [C0805K]
C307  4,7uF  C-EUC0805K  [C0805K]
C308  100nF  C-EUC0805K  [C0805K]
C309  22pF  C-EUC0805K  [C0805K]
C310  22pF  C-EUC0805K  [C0805K]
C311  100nF  C-EUC0805K  [C0805K]
C312  100nF  C-EUC0805K  [C0805K]
C313  100nF  C-EUC0805K  [C0805K]
C314  100nF  C-EUC0805K  [C0805K]
C315  100nF  C-EUC0805K  [C0805K]
C316  220uF  MYRCL_CPOL-EU153CLV-0810  [MYRCL_153CLV-0810]
D1  MBR_12V  SUPPRESSOR-SMBJ  [SMBJ]
IC1  TPS53353_TPS53355_DQP_22  TPS53355_DQP_22  [DQP22_5P479X3P24]
IC2  TPS53353_TPS53355_DQP_22  TPS53355_DQP_22  [DQP22_5P479X3P24]
IC3  TPS53353_TPS53355_DQP_22  TPS53355_DQP_22  [DQP22_5P479X3P24]
IC4  TPS53353_TPS53355_DQP_22  TPS53355_DQP_22  [DQP22_5P479X3P24]
IC5  TPS53353_TPS53355_DQP_22  TPS53355_DQP_22  [DQP22_5P479X3P24]
IC6  TPS53353_TPS53355_DQP_22  TPS53355_DQP_22  [DQP22_5P479X3P24]
IC7  TPS53353_TPS53355_DQP_22  TPS53355_DQP_22  [DQP22_5P479X3P24]
IC8  TPS53353_TPS53355_DQP_22  TPS53355_DQP_22  [DQP22_5P479X3P24]
IC9  BE200_QFN64_9X9  [QFN64-9X9]
IC10  BE200_QFN64_9X9  [QFN64-9X9]
IC11  BE200_QFN64_9X9  [QFN64-9X9]
IC12  BE200_QFN64_9X9  [QFN64-9X9]
IC13  BE200_QFN64_9X9  [QFN64-9X9]
IC14  BE200_QFN64_9X9  [QFN64-9X9]
IC15  BE200_QFN64_9X9  [QFN64-9X9]
IC16  BE200_QFN64_9X9  [QFN64-9X9]
IC17  BE200_QFN64_9X9  [QFN64-9X9]
IC18  BE200_QFN64_9X9  [QFN64-9X9]
IC19  BE200_QFN64_9X9  [QFN64-9X9]
IC20  BE200_QFN64_9X9  [QFN64-9X9]
IC21  BE200_QFN64_9X9  [QFN64-9X9]
IC22  BE200_QFN64_9X9  [QFN64-9X9]
IC23  BE200_QFN64_9X9  [QFN64-9X9]
IC24  BE200_QFN64_9X9  [QFN64-9X9]
IC25  BE200_QFN64_9X9  [QFN64-9X9]
IC26  BE200_QFN64_9X9  [QFN64-9X9]
IC27  BE200_QFN64_9X9  [QFN64-9X9]
IC28  BE200_QFN64_9X9  [QFN64-9X9]
IC29  BE200_QFN64_9X9  [QFN64-9X9]
IC30  BE200_QFN64_9X9  [QFN64-9X9]
IC31  BE200_QFN64_9X9  [QFN64-9X9]
IC32  BE200_QFN64_9X9  [QFN64-9X9]
IC33  AOZ1021  [AOZ1021]
IC34  TLV71209DBV  VREG_5PINS-SOT-23-5  [SOT-23-5]
IC35  TLV7  VREG_5PINS-SOT-23-5  [SOT-23-5]
IC36  MEGA88-AU  MEGA48/88/168-AU  [TQFP32-08]
IC37  74HC138D  [SO16]
IC38  74HC138D  [SO16]
IC39  74HC138D  [SO16]
IC40  74HC138D  [SO16]
IC41  7407D  [SO14]
L1  0.47uH  INDCUTOR_PA0513  [INDUCTOR_PA0513]
L2  0.47uH  INDCUTOR_PA0513  [INDUCTOR_PA0513]
L3  0.47uH  INDCUTOR_PA0513  [INDUCTOR_PA0513]
L4  0.47uH  INDCUTOR_PA0513  [INDUCTOR_PA0513]
L5  0.47uH  INDCUTOR_PA0513  [INDUCTOR_PA0513]
L6  0.47uH  INDCUTOR_PA0513  [INDUCTOR_PA0513]
L7  0.47uH  INDCUTOR_PA0513  [INDUCTOR_PA0513]
L8  0.47uH  INDCUTOR_PA0513  [INDUCTOR_PA0513]
L9  4.7uH  INDUCTOR_7.3X7.3  [INDCUCTOR_7.3X7.3]
Q1  20MHZ  OSC-OSCILLATOR  [OSCILLATOR_7X5_SMD]
Q2  7.37MHZ  CRYSTALHC49UP  [HC49UP]
R1  39K  R-EU_R0805K  [R0805K]
R2  180K  R-EU_R0805K  [R0805K]
R3  200K  R-EU_R0805K  [R0805K]
R4  100K  R-EU_R0805K  [R0805K]
R5  10K  R-EU_R0805K  [R0805K]
R6  2K49  R-EU_R0805K  [R0805K]
R7  56K  R-EU_R0805K  [R0805K]
R8  3 or 3.01  R-EU_R0805K  [R0805K]
R9  39K  R-EU_R0805K  [R0805K]
R10  180K  R-EU_R0805K  [R0805K]
R11  200K  R-EU_R0805K  [R0805K]
R12  100K  R-EU_R0805K  [R0805K]
R13  10K  R-EU_R0805K  [R0805K]
R14  2K49  R-EU_R0805K  [R0805K]
R15  56K  R-EU_R0805K  [R0805K]
R16  3 or 3.01  R-EU_R0805K  [R0805K]
R17  39K  R-EU_R0805K  [R0805K]
R18  180K  R-EU_R0805K  [R0805K]
R19  200K  R-EU_R0805K  [R0805K]
R20  100K  R-EU_R0805K  [R0805K]
R21  10K  R-EU_R0805K  [R0805K]
R22  2K49  R-EU_R0805K  [R0805K]
R23  56K  R-EU_R0805K  [R0805K]
R24  3 or 3.01  R-EU_R0805K  [R0805K]
R25  39K  R-EU_R0805K  [R0805K]
R26  180K  R-EU_R0805K  [R0805K]
R27  200K  R-EU_R0805K  [R0805K]
R28  100K  R-EU_R0805K  [R0805K]
R29  10K  R-EU_R0805K  [R0805K]
R30  2K49  R-EU_R0805K  [R0805K]
R31  56K  R-EU_R0805K  [R0805K]
R32  3 or 3.01  R-EU_R0805K  [R0805K]
R33  39K  R-EU_R0805K  [R0805K]
R34  180K  R-EU_R0805K  [R0805K]
R35  200K  R-EU_R0805K  [R0805K]
R36  100K  R-EU_R0805K  [R0805K]
R37  10K  R-EU_R0805K  [R0805K]
R38  2K49  R-EU_R0805K  [R0805K]
R39  56K  R-EU_R0805K  [R0805K]
R40  3 or 3.01  R-EU_R0805K  [R0805K]
R41  39K  R-EU_R0805K  [R0805K]
R42  180K  R-EU_R0805K  [R0805K]
R43  200K  R-EU_R0805K  [R0805K]
R44  100K  R-EU_R0805K  [R0805K]
R45  10K  R-EU_R0805K  [R0805K]
R46  2K49  R-EU_R0805K  [R0805K]
R47  56K  R-EU_R0805K  [R0805K]
R48  3 or 3.01  R-EU_R0805K  [R0805K]
R49  39K  R-EU_R0805K  [R0805K]
R50  180K  R-EU_R0805K  [R0805K]
R51  200K  R-EU_R0805K  [R0805K]
R52  100K  R-EU_R0805K  [R0805K]
R53  10K  R-EU_R0805K  [R0805K]
R54  2K49  R-EU_R0805K  [R0805K]
R55  56K  R-EU_R0805K  [R0805K]
R56  3 or 3.01  R-EU_R0805K  [R0805K]
R57  39K  R-EU_R0805K  [R0805K]
R58  180K  R-EU_R0805K  [R0805K]
R59  200K  R-EU_R0805K  [R0805K]
R60  100K  R-EU_R0805K  [R0805K]
R61  10K  R-EU_R0805K  [R0805K]
R62  2K49  R-EU_R0805K  [R0805K]
R63  56K  R-EU_R0805K  [R0805K]
R64  3 or 3.01  R-EU_R0805K  [R0805K]
R65  7K5  R-EU_R0805K  [R0805K]
R66  7K5  R-EU_R0805K  [R0805K]
R67  7K5  R-EU_R0805K  [R0805K]
R68  2K4  R-EU_R0805K  [R0805K]
R69  4K7  R-EU_R0805K  [R0805K]
R70  4K7  R-EU_R0805K  [R0805K]
S1  219-05  [CTS-219-05]
X1  MINI-FIT-JR-065.5MM  [PCIE6_4.2]
X2  MINI-FIT-JR-065.5MM  [PCIE6_4.2]
X3  22-23-2031  [22-23-2031]
X4  XH2.54-3P  [XH2.54-3P]
X5  XH2.54-3P  [XH2.54-3P]
X6  AVR-ISP-6VERT  [AVR-ISP-6]

## Nets
0.9V [xpower]: C130.1 C137.1 C144.1 C151.1 C158.1 C165.1 C172.1 C179.1 C186.1 C193.1 C200.1 C207.1 C214.1 C221.1 C228.1 C235.1 C242.1 C249.1 C256.1 C263.1 C270.1 C277.1 C284.1 C291.1 C302.2 IC9.8(PLLDVDD) IC9.10(PLLVDD) IC10.8(PLLDVDD) IC10.10(PLLVDD) IC11.8(PLLDVDD) IC11.10(PLLVDD) IC12.8(PLLDVDD) IC12.10(PLLVDD) IC13.8(PLLDVDD) IC13.10(PLLVDD) IC14.8(PLLDVDD) IC14.10(PLLVDD) IC15.8(PLLDVDD) IC15.10(PLLVDD) IC16.8(PLLDVDD) IC16.10(PLLVDD) IC17.8(PLLDVDD) IC17.10(PLLVDD) IC18.8(PLLDVDD) IC18.10(PLLVDD) IC19.8(PLLDVDD) IC19.10(PLLVDD) IC20.8(PLLDVDD) IC20.10(PLLVDD) IC21.8(PLLDVDD) IC21.10(PLLVDD) IC22.8(PLLDVDD) IC22.10(PLLVDD) IC23.8(PLLDVDD) IC23.10(PLLVDD) IC24.8(PLLDVDD) IC24.10(PLLVDD) IC25.8(PLLDVDD) IC25.10(PLLVDD) IC26.8(PLLDVDD) IC26.10(PLLVDD) IC27.8(PLLDVDD) IC27.10(PLLVDD) IC28.8(PLLDVDD) IC28.10(PLLVDD) IC29.8(PLLDVDD) IC29.10(PLLVDD) IC30.8(PLLDVDD) IC30.10(PLLVDD) IC31.8(PLLDVDD) IC31.10(PLLVDD) IC32.8(PLLDVDD) IC32.10(PLLVDD) IC34.5(OUT)
1.8V [xpower]: C129.2 C131.1 C136.2 C138.1 C143.2 C145.1 C150.2 C152.1 C157.2 C159.1 C164.2 C166.1 C171.2 C173.1 C178.2 C180.1 C185.2 C187.1 C192.2 C194.1 C199.2 C201.1 C206.2 C208.1 C213.2 C215.1 C220.2 C222.1 C227.2 C229.1 C234.2 C236.1 C241.2 C243.1 C248.2 C250.1 C255.2 C257.1 C262.2 C264.1 C269.2 C271.1 C276.2 C278.1 C283.2 C285.1 C290.2 C292.1 C304.2 IC9.5(PLLIOVDD) IC9.6(PLLAHVDD) IC9.25(VDD_IO) IC9.37(VDD_IO) IC9.56(VDD_IO) IC10.5(PLLIOVDD) IC10.6(PLLAHVDD) IC10.25(VDD_IO) IC10.37(VDD_IO) IC10.56(VDD_IO) IC11.5(PLLIOVDD) IC11.6(PLLAHVDD) IC11.25(VDD_IO) IC11.37(VDD_IO) IC11.56(VDD_IO) IC12.5(PLLIOVDD) IC12.6(PLLAHVDD) IC12.25(VDD_IO) IC12.37(VDD_IO) IC12.56(VDD_IO) IC13.5(PLLIOVDD) IC13.6(PLLAHVDD) IC13.25(VDD_IO) IC13.37(VDD_IO) IC13.56(VDD_IO) IC14.5(PLLIOVDD) IC14.6(PLLAHVDD) IC14.25(VDD_IO) IC14.37(VDD_IO) IC14.56(VDD_IO) IC15.5(PLLIOVDD) IC15.6(PLLAHVDD) IC15.25(VDD_IO) IC15.37(VDD_IO) IC15.56(VDD_IO) IC16.5(PLLIOVDD) IC16.6(PLLAHVDD) IC16.25(VDD_IO) IC16.37(VDD_IO) IC16.56(VDD_IO) IC17.5(PLLIOVDD) IC17.6(PLLAHVDD) IC17.25(VDD_IO) IC17.37(VDD_IO) IC17.56(VDD_IO) IC18.5(PLLIOVDD) IC18.6(PLLAHVDD) IC18.25(VDD_IO) IC18.37(VDD_IO) IC18.56(VDD_IO) IC19.5(PLLIOVDD) IC19.6(PLLAHVDD) IC19.25(VDD_IO) IC19.37(VDD_IO) IC19.56(VDD_IO) IC20.5(PLLIOVDD) IC20.6(PLLAHVDD) IC20.25(VDD_IO) IC20.37(VDD_IO) IC20.56(VDD_IO) IC21.5(PLLIOVDD) IC21.6(PLLAHVDD) IC21.25(VDD_IO) IC21.37(VDD_IO) IC21.56(VDD_IO) IC22.5(PLLIOVDD) IC22.6(PLLAHVDD) IC22.25(VDD_IO) IC22.37(VDD_IO) IC22.56(VDD_IO) IC23.5(PLLIOVDD) IC23.6(PLLAHVDD) IC23.25(VDD_IO) IC23.37(VDD_IO) IC23.56(VDD_IO) IC24.5(PLLIOVDD) IC24.6(PLLAHVDD) IC24.25(VDD_IO) IC24.37(VDD_IO) IC24.56(VDD_IO) IC25.5(PLLIOVDD) IC25.6(PLLAHVDD) IC25.25(VDD_IO) IC25.37(VDD_IO) IC25.56(VDD_IO) IC26.5(PLLIOVDD) IC26.6(PLLAHVDD) IC26.25(VDD_IO) IC26.37(VDD_IO) IC26.56(VDD_IO) IC27.5(PLLIOVDD) IC27.6(PLLAHVDD) IC27.25(VDD_IO) IC27.37(VDD_IO) IC27.56(VDD_IO) IC28.5(PLLIOVDD) IC28.6(PLLAHVDD) IC28.25(VDD_IO) IC28.37(VDD_IO) IC28.56(VDD_IO) IC29.5(PLLIOVDD) IC29.6(PLLAHVDD) IC29.25(VDD_IO) IC29.37(VDD_IO) IC29.56(VDD_IO) IC30.5(PLLIOVDD) IC30.6(PLLAHVDD) IC30.25(VDD_IO) IC30.37(VDD_IO) IC30.56(VDD_IO) IC31.5(PLLIOVDD) IC31.6(PLLAHVDD) IC31.25(VDD_IO) IC31.37(VDD_IO) IC31.56(VDD_IO) IC32.5(PLLIOVDD) IC32.6(PLLAHVDD) IC32.25(VDD_IO) IC32.37(VDD_IO) IC32.56(VDD_IO) IC35.5(OUT)
+3V3 [power]: C299.1 C300.1 C301.2 C303.2 C305.2 C306.2 C307.2 C311.2 C312.2 C313.2 C314.2 C315.2 IC34.1(IN) IC34.3(EN) IC35.1(IN) IC35.3(EN) IC36.4(VCC) IC36.6(VCC) IC36.18(AVCC) IC37.16(VCC) IC38.6(G1) IC38.16(VCC) IC39.6(G1) IC39.16(VCC) IC40.6(G1) IC40.16(VCC) IC41.14(P:VCC) L9.2 Q1.1(EN) Q1.4(VCC) R67.2 R69.2 R70.2 X6.2
+12V: C1.+ C2.1 C3.1 C4.1 C5.1 C7.1 C17.+ C18.1 C19.1 C20.1 C21.1 C23.1 C33.+ C34.1 C35.1 C36.1 C37.1 C39.1 C49.+ C50.1 C51.1 C52.1 C53.1 C55.1 C65.+ C66.1 C67.1 C68.1 C69.1 C71.1 C81.+ C82.1 C83.1 C84.1 C85.1 C87.1 C97.+ C98.1 C99.1 C100.1 C101.1 C103.1 C113.+ C114.1 C115.1 C116.1 C117.1 C119.1 C297.1 C316.+ D1.C IC1.12(VIN_2) IC1.13(VIN_3) IC1.14(VIN_4) IC1.15(VIN_5) IC1.16(VIN_6) IC1.17(VIN) IC1.19(VDD) IC2.12(VIN_2) IC2.13(VIN_3) IC2.14(VIN_4) IC2.15(VIN_5) IC2.16(VIN_6) IC2.17(VIN) IC2.19(VDD) IC3.12(VIN_2) IC3.13(VIN_3) IC3.14(VIN_4) IC3.15(VIN_5) IC3.16(VIN_6) IC3.17(VIN) IC3.19(VDD) IC4.12(VIN_2) IC4.13(VIN_3) IC4.14(VIN_4) IC4.15(VIN_5) IC4.16(VIN_6) IC4.17(VIN) IC4.19(VDD) IC5.12(VIN_2) IC5.13(VIN_3) IC5.14(VIN_4) IC5.15(VIN_5) IC5.16(VIN_6) IC5.17(VIN) IC5.19(VDD) IC6.12(VIN_2) IC6.13(VIN_3) IC6.14(VIN_4) IC6.15(VIN_5) IC6.16(VIN_6) IC6.17(VIN) IC6.19(VDD) IC7.12(VIN_2) IC7.13(VIN_3) IC7.14(VIN_4) IC7.15(VIN_5) IC7.16(VIN_6) IC7.17(VIN) IC7.19(VDD) IC8.12(VIN_2) IC8.13(VIN_3) IC8.14(VIN_4) IC8.15(VIN_5) IC8.16(VIN_6) IC8.17(VIN) IC8.19(VDD) IC33.VIN R3.2 R11.2 R19.2 R27.2 R35.2 R43.2 R51.2 R59.2 R65.2 X1.P1 X1.P2 X1.P3 X2.P1 X2.P2 X2.P3 X3.2
/CS_EN: IC36.14(PB2(SS/OC1B/PCINT2)) IC37.4(G2A) IC37.5(G2B) R70.1
A0: IC36.23(PC0(ADC0/PCINT8)) IC38.1(A) IC39.1(A) IC40.1(A)
A1: IC36.24(PC1(ADC1/PCINT9)) IC38.2(B) IC39.2(B) IC40.2(B)
A2: IC36.25(PC2(ADC2/PCINT10)) IC38.3(C) IC39.3(C) IC40.3(C)
A3: IC36.26(PC3(ADC3/PCINT11)) IC37.1(A)
A4: IC36.27(PC4(ADC4/SDA/PCINT12)) IC37.2(B)
BID0: IC36.32(PD2(INT0/PCINT18)) S1.5
BID1: IC36.1(PD3(INT1/OC2B/PCINT19)) S1.4
BID2: IC36.2(PD4(T0/XCK/PCINT20)) S1.3
BID3: IC36.9(PD5(T1/OC0B/PCINT21)) S1.2
BID4: IC36.10(PD6(AIN0/OC0A/PCINT22)) S1.1
BS: IC9.13(BS) IC10.13(BS) IC11.13(BS) IC12.13(BS) IC13.13(BS) IC14.13(BS) IC15.13(BS) IC16.13(BS) IC17.13(BS) IC18.13(BS) IC19.13(BS) IC20.13(BS) IC21.13(BS) IC22.13(BS) IC23.13(BS) IC24.13(BS) IC25.13(BS) IC26.13(BS) IC27.13(BS) IC28.13(BS) IC29.13(BS) IC30.13(BS) IC31.13(BS) IC32.13(BS) IC36.11(PD7(AIN1/PCINT23))
CE0: IC37.15(Y0) IC38.4(G2A) IC38.5(G2B)
CE1: IC37.14(Y1) IC39.4(G2A) IC39.5(G2B)
CE2: IC37.13(Y2) IC40.4(G2A) IC40.5(G2B)
CS0: IC9.39(/CS_(SS)) IC38.15(Y0)
CS1: IC10.39(/CS_(SS)) IC38.14(Y1)
CS2: IC11.39(/CS_(SS)) IC38.13(Y2)
CS3: IC12.39(/CS_(SS)) IC38.12(Y3)
CS4: IC13.39(/CS_(SS)) IC38.11(Y4)
CS5: IC14.39(/CS_(SS)) IC38.10(Y5)
CS6: IC15.39(/CS_(SS)) IC38.9(Y6)
CS7: IC16.39(/CS_(SS)) IC38.7(Y7)
CS8: IC17.39(/CS_(SS)) IC39.15(Y0)
CS9: IC18.39(/CS_(SS)) IC39.14(Y1)
CS10: IC19.39(/CS_(SS)) IC39.13(Y2)
CS11: IC20.39(/CS_(SS)) IC39.12(Y3)
CS12: IC21.39(/CS_(SS)) IC39.11(Y4)
CS13: IC22.39(/CS_(SS)) IC39.10(Y5)
CS14: IC23.39(/CS_(SS)) IC39.9(Y6)
CS15: IC24.39(/CS_(SS)) IC39.7(Y7)
CS16: IC25.39(/CS_(SS)) IC40.15(Y0)
CS17: IC26.39(/CS_(SS)) IC40.14(Y1)
CS18: IC27.39(/CS_(SS)) IC40.13(Y2)
CS19: IC28.39(/CS_(SS)) IC40.12(Y3)
CS20: IC29.39(/CS_(SS)) IC40.11(Y4)
CS21: IC30.39(/CS_(SS)) IC40.10(Y5)
CS22: IC31.39(/CS_(SS)) IC40.9(Y6)
CS23: IC32.39(/CS_(SS)) IC40.7(Y7)
EN_SITE1: IC1.2(EN) R3.1 R4.2
EN_SITE2: IC2.2(EN) R11.1 R12.2
EN_SITE3: IC3.2(EN) R19.1 R20.2
EN_SITE4: IC4.2(EN) R27.1 R28.2
EN_SITE5: IC5.2(EN) R35.1 R36.2
EN_SITE6: IC6.2(EN) R43.1 R44.2
EN_SITE7: IC7.2(EN) R51.1 R52.2
EN_SITE8: IC8.2(EN) R59.1 R60.2